# EasyEDA Pro project Esp32.eprj

# Schematic Schematic1
Board Name: Board1; Create Date: 2025-08-05; Page Name: P1; Project Name: Esp32; Schematic Name: Schematic1; Update Date: 2025-09-13; Company: EasyEDA.com; Page Size: A4; Version: V1.0
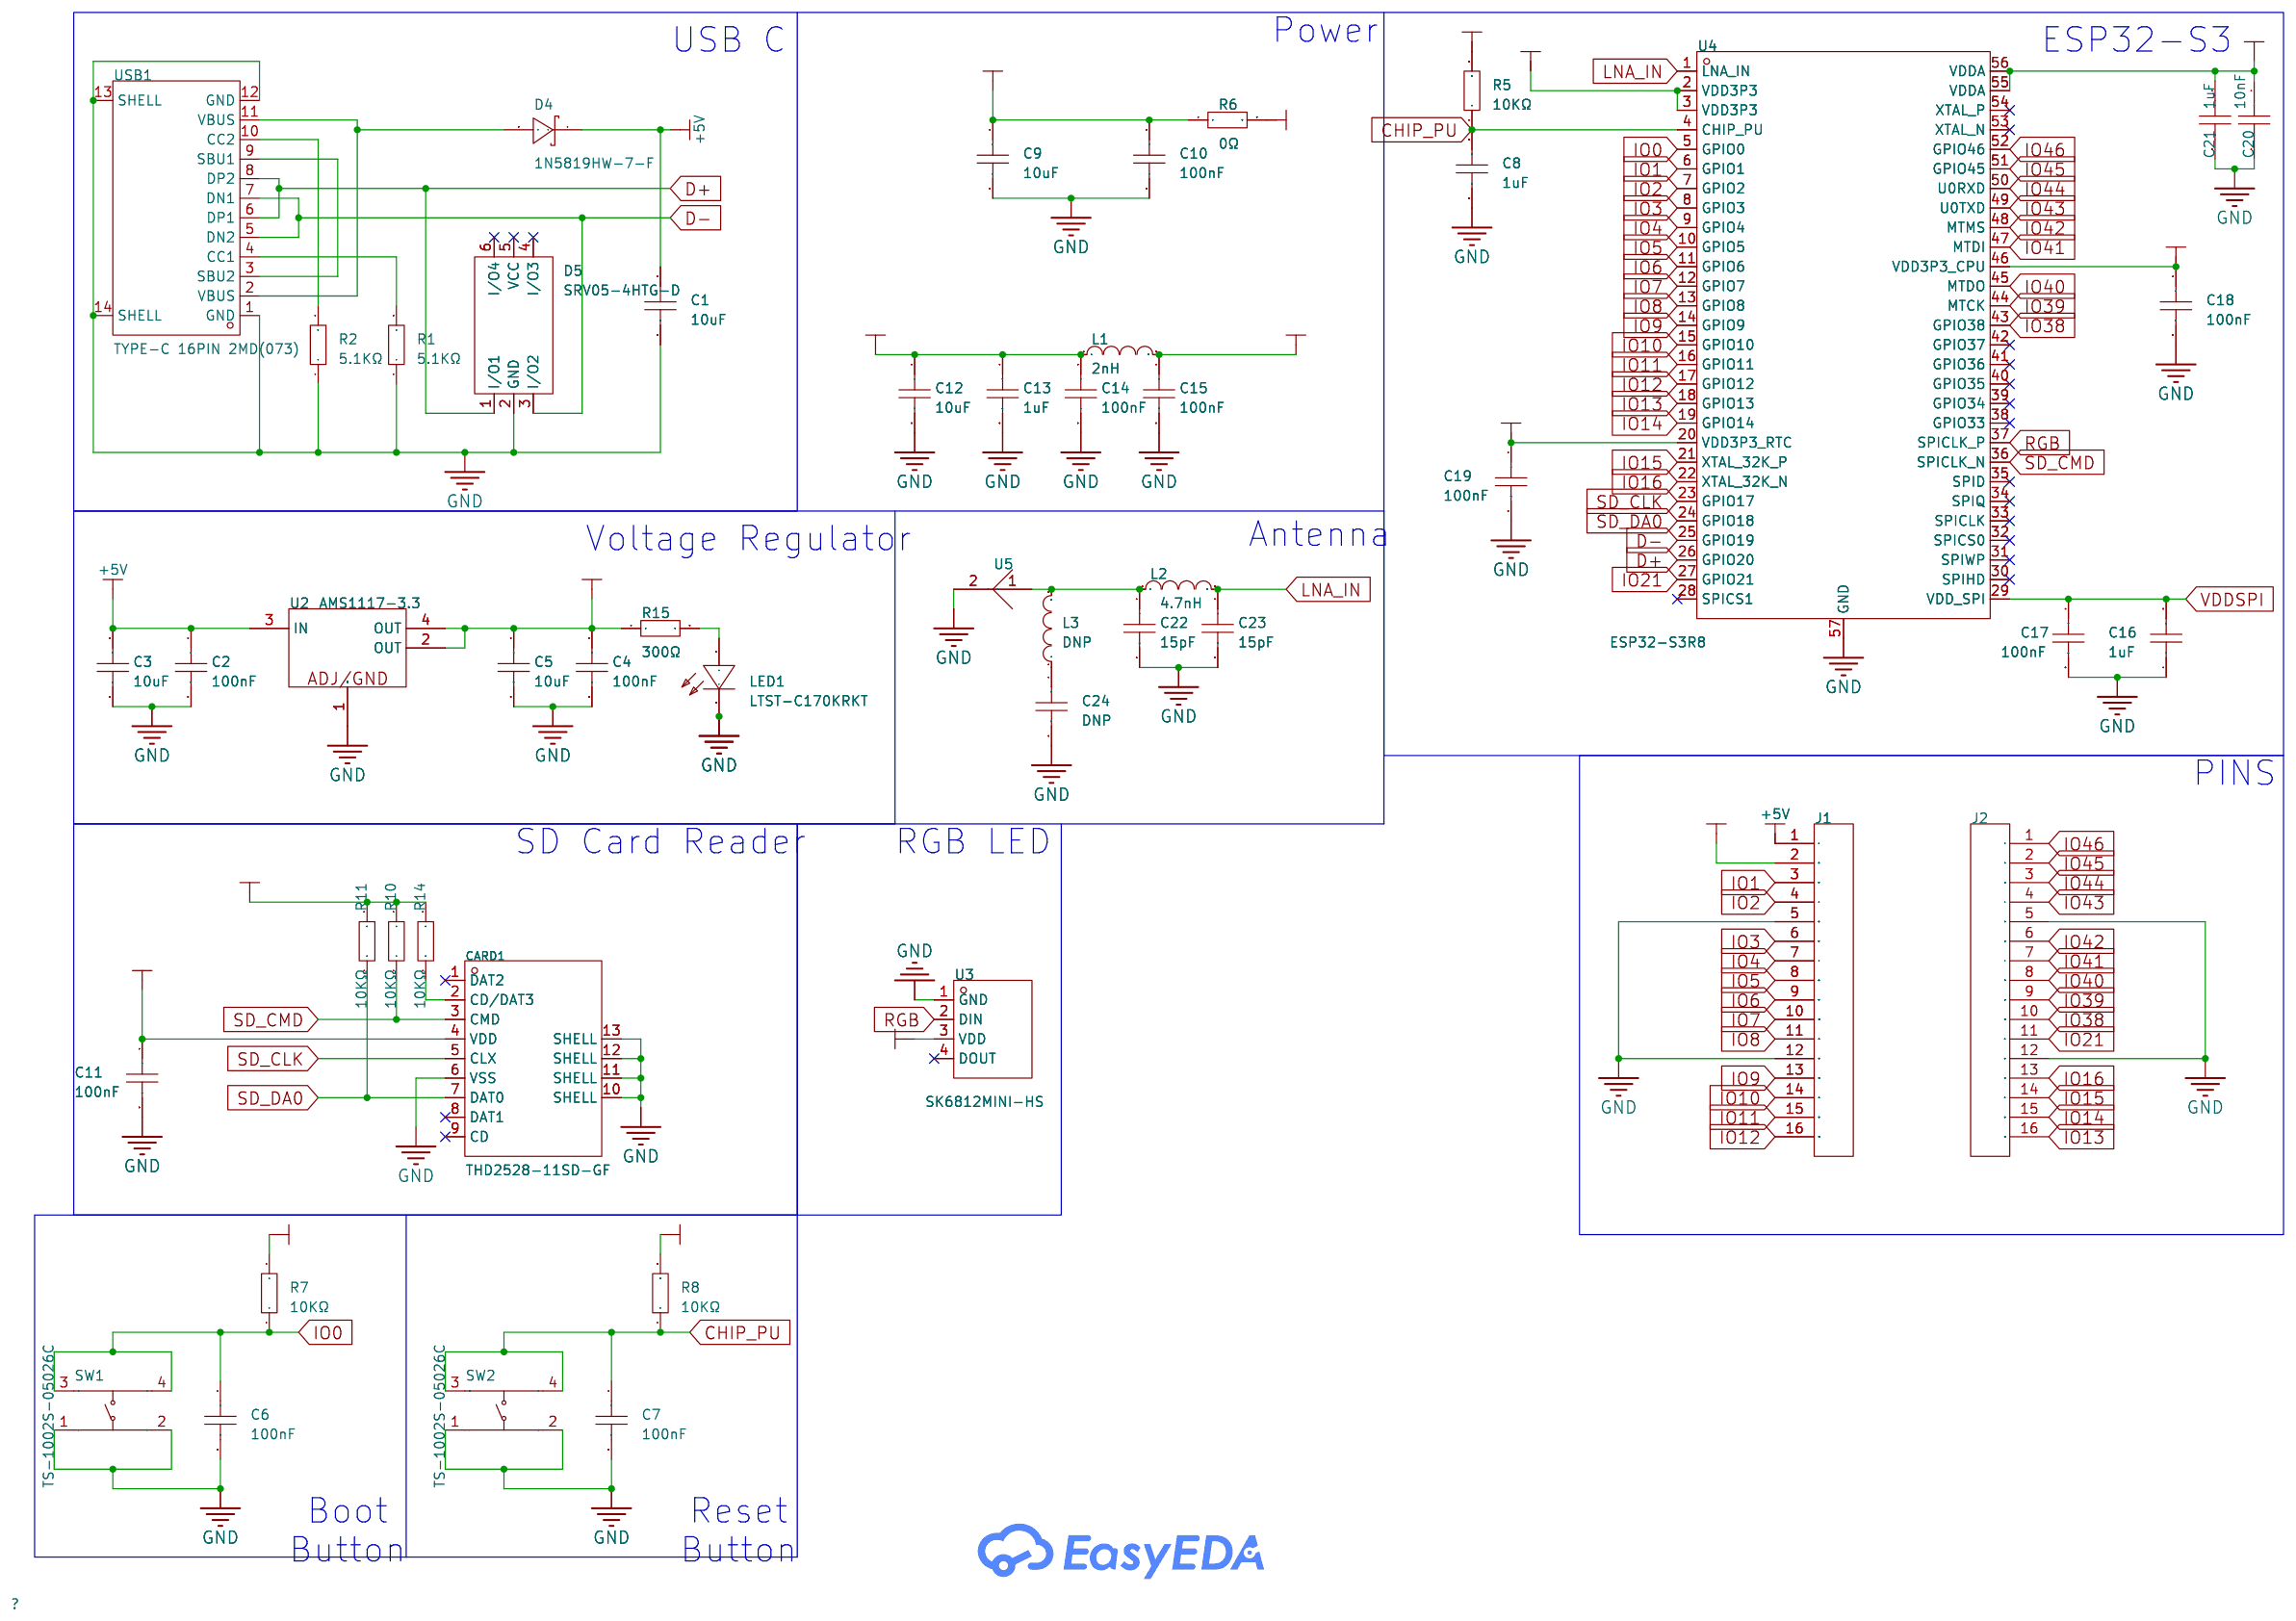
[diagram p0: schematic sheet]

## Parts
C1  10uF  [C0402]
C2  100nF  [C0402]
C3  10uF  [C0402]
C4  100nF  [C0402]
C5  10uF  [C0402]
C6  100nF  [C0402]
C7  100nF  [C0402]
C8  1uF  [C0402]
C9  10uF  [C0402]
C10  100nF  [C0402]
C11  100nF  [C0402]
C12  10uF  [C0402]
C13  1uF  [C0402]
C14  100nF  [C0402]
C15  100nF  [C0402]
C16  1uF  [C0402]
C17  100nF  [C0402]
C18  100nF  [C0402]
C19  100nF  [C0402]
C20  10nF  [C0402]
C21  1uF  [C0402]
C22  15pF  [C0402]
C23  15pF  [C0402]
C24  DNP  [C0402]
CARD1  THD2528-11SD-GF  [TF-SMD_THD2528-11SD-GF]
D4  1N5819HW-7-F  [SOD-123_L2.7-W1.6-LS3.7-RD]
D5  SRV05-4HTG-D  [SOT-23-6_L2.9-W1.6-P0.95-LS2.8-BR]
J1  -  [PinHeader_1x16_P2.54mm_Vertical]
J2  -  [PinHeader_1x16_P2.54mm_Vertical]
L1  2nH  [L0603]
L2  4.7nH  [L0603]
L3  DNP  [L0603]
LED1  LTST-C170KRKT  [LED0805-R-RD]
R1  5.1KΩ  [R0603]
R2  5.1KΩ  [R0603]
R5  10KΩ  [R0402]
R6  0Ω  [R0402]
R7  10KΩ  [R0603]
R8  10KΩ  [R0603]
R10  10KΩ  [R0603]
R11  10KΩ  [R0603]
R14  10KΩ  [R0603]
R15  300Ω  [R0603]
SW1  TS-1002S-05026C  [KEY-SMD_4P-L6.0-W6.0-P4.50-LS9.0]
SW2  TS-1002S-05026C  [KEY-SMD_4P-L6.0-W6.0-P4.50-LS9.0]
U2  AMS1117-3.3  [SOT-223-3_L6.4-W3.5-P2.30-LS7.0-BR]
U3  SK6812MINI-HS  [LED-SMD_4P-L3.5-W3.5-BR_SK6812MINI-HS]
U4  ESP32-S3R8  [QFN-56_L7.0-W7.0-P0.40-TL-EP4.0]
U5  -  [Texas_SWRA117D_2.4GHz_Right]
USB1  TYPE-C 16PIN 2MD(073)  [USB-C-SMD_TYPE-C-6PIN-2MD-073]

## Library data of the parts
C1-C24 = CAP_0402: Supplier Part: C1525; Supplier Footprint: 0402
CARD1 = THD2528-11SD-GF: LCSC Part Name: 自弹式 MicroSD卡(TF卡) 卡座; Supplier Part: C283232; Manufacturer: THD(台华达); Supplier Footprint: SMD; Datasheet: https://atta.szlcsc.com/upload/public/pdf/source/20190329/C283232_532F94C79FB51CC42613BF324E8B5690.pdf; Supplier: LCSC; Card Connection Mode: Self bomb; Card Type: MicroSD卡(TF卡); Connector Type: Deck; Maximum Body Height: 2mm
D4 = 1N5819HW-7-F: LCSC Part Name: 电压:40V 电流:1A; Supplier Part: C82544; Manufacturer: DIODES(美台); Supplier Footprint: SOD-123; JLCPCB Part Class: Extended Part; Datasheet: https://atta.szlcsc.com/upload/public/pdf/source/20161024/1477288459223.pdf; Supplier: LCSC; Forward Voltage (Vf@If): 450mV@1A; Reverse Voltage (Vr): 40V; Rectified Current: 1A; Reverse Leakage Current (Ir): 1mA@40V
D5 = SRV05-4HTG-D: Supplier Part: C1975211; Manufacturer: Littelfuse(美国力特); Supplier Footprint: SOT-23-6; Datasheet: https://item.szlcsc.com/datasheet/SRV05-4HTG-D/2066749.html; Supplier: LCSC; Reverse Stand-Off Voltage (Vrwm): 6V; Clamping Voltage: 15V; Peak Pulse Current (Ipp): 10A@8/20us; Peak Pulse Power Dissipation (Ppp): 150W@8/20us; Voltage - Breakdown: 6V; Reverse Leakage Current (Ir): 500nA; Number of Channels: 4; level of protection: IEC 61000-4-4；IEC 61000-4-5；IEC 61000-4-2; Type: ESD; Junction Capacitance: 1pF
J1 J2 = Conn_1x16
L1 = VHF160808H2N0ST: LCSC Part Name: 2nH ±0.3nH; Supplier Part: C395081; Manufacturer: FH(风华); Supplier Footprint: 0603; JLCPCB Part Class: Extended Part; Datasheet: https://atta.szlcsc.com/upload/public/pdf/source/20230223/8EF545BE87E825DABED9AF3380ABCE94.pdf; Supplier: LCSC
L2 = VHF160808H4N7ST: LCSC Part Name: 4.7nH ±0.3nH; Supplier Part: C1030; Manufacturer: FH(风华); Supplier Footprint: 0603; Datasheet: https://atta.szlcsc.com/upload/public/pdf/source/20230223/8EF545BE87E825DABED9AF3380ABCE94.pdf; Supplier: LCSC
L3 = L_0603
LED1 = LTST-C170KRKT: Supplier Part: C94868; Manufacturer: LITEON(光宝); Supplier Footprint: 0805; JLCPCB Part Class: Extended Part; Datasheet: https://atta.szlcsc.com/upload/public/pdf/source/20170325/1490427902593.pdf; Supplier: LCSC; Emitted Color: Red; Forward Voltage (VF): 2V; Power Dissipation: 75mW; Forward Current: 20mA; Dominant Wavelength: 631nm; Peak Wavelength: 639nm; Lens Color: Colorless Transparent Lens; Luminous Intensity: 54mcd; Viewing Angle: 130°; Operating Temperature: -55℃~+85℃
R1 R2 R7 R8 R10 R11 R14 R15 = Res_0603: Supplier Footprint: 0603
R5 R6 = Res_0402: Supplier Footprint: 0402
SW1 SW2 = TS-1002S-05026C: Circuit:SPST Actuator Style:Round Button Mounting Type:Surface Mount,Vertical Length:6mm Width:6mm Switch Height:5mm Contact Current:50mA Voltage Rating:12V With Lamp:- Life:-; LCSC Part Name: 6*6*5mm 立贴 轻触开关; Supplier Part: C455110; Manufacturer: XUNPU(讯普); Supplier Footprint: SMD-4P,6x6mm; JLCPCB Part Class: Extended Part; Datasheet: https://item.szlcsc.com/datasheet/TS-1002S-05026C/457515.html; Supplier: LCSC; Circuit: SPST; Actuator Style: Round Button; Mounting Type: Surface Mount,Vertical; Length: 6mm; Width: 6mm; Switch Height: 5mm; Contact Current: 50mA; Voltage Rating: 12V
U2 = AMS1117-3.3: Supplier Part: C2992570; Manufacturer: 国芯佳品; Supplier Footprint: SOT-223-3; JLCPCB Part Class: Extended Part; Datasheet: https://atta.szlcsc.com/upload/public/pdf/source/20220729/0D21C21EC310E4778671BF6BAE438640.pdf; Supplier: LCSC; Output Type: Fixed; Voltage - Supply: 15V; Output Voltage: 3.3V; Output Current: 1A; Features: Overcurrent Protection(OCP); Operating Temperature: -40℃~+125℃; Output Configuration: Positive electrode; Number of Outputs: 1
U3 = SK6812MINI-HS: Supplier Part: C2922787; Manufacturer: 欧思科光电; Supplier Footprint: SMD,3.5x3.7mm; Datasheet: https://item.szlcsc.com/datasheet/SK6812MINI-HS/3234155.html; Supplier: LCSC
U4 = ESP32-S3R8: Supplier Part: C2913194; Manufacturer: ESPRESSIF(乐鑫); Supplier Footprint: QFN-56(7x7); JLCPCB Part Class: Extended Part; Datasheet: https://item.szlcsc.com/datasheet/ESP32-S3R8/3198292.html; Supplier: LCSC; Frequency Range: 2.412GHz~2.484GHz; Interface: I2C；I2S；UART；USB；SPI; Voltage - Supply: 3V~3.6V; Applications: Bluetooth；IoT；WiFi; Output Power: 18.5dBm; Data Rate: 150Mbps; Current Of Transmitting: 283mA; Sensitivity: -74.2dBm; Receive Current: 88mA; Typical Application Frequency: 2.4GHz; Operating Temperature: -40℃~+65℃
U5 = Texas_SWRA117D_2.4GHz_Right
USB1 = TYPE-C 16PIN 2MD(073): LCSC Part Name: Type-C 母 卧贴; Supplier Part: C2765186; Manufacturer: SHOU HAN(首韩); Supplier Footprint: SMD; JLCPCB Part Class: Extended Part; Datasheet: https://atta.szlcsc.com/upload/public/pdf/source/20250506/FFB74EDFDFA0AC372CE4A8E4F739CCEF.pdf; Supplier: LCSC; Connector Type: Type-C; Protocol Standard: USB 3.1; Gender: Female; Mounting Type: Surface Mount, Right Angle; Number of Contacts: 16P; Number of Ports: 1; Current Rating-Power: 3A; Voltage Rating: 5V; Connect-Disconnect Life: 5,000 Cycles; Detection color: Black; Operating Temperature: -25℃~+85℃

## Nets
+3V3: C4.1 C5.1 C9.1 C10.1 C11.1 CARD1.4(VDD) J1.2 R6.1 R7.2 R8.2 R10.2 R11.2 R14.2 R15.1 U2.2(OUT) U2.4(OUT) U3.3(VDD)
+5V: C1.1 C2.1 C3.1 D4.1(K) J1.1 U2.3(IN)
GND: C1.2 C2.2 C3.2 C4.2 C5.2 C6.2 C7.2 C8.2 C9.2 C10.2 C11.2 C12.2 C13.2 C14.2 C15.2 C16.1 C17.2 C18.2 C19.2 C20.2 C21.2 C22.2 C23.2 C24.2 CARD1.6(VSS) CARD1.10(SHELL) CARD1.11(SHELL) CARD1.12(SHELL) CARD1.13(SHELL) D5.2(GND) J1.5 J1.12 J2.5 J2.12 LED1.2(-) R1.1 R2.1 SW1.1 SW1.2 SW2.1 SW2.2 U2.1(ADJ/GND) U3.1(GND) U4.57(GND) U5.2 USB1.1(GND) USB1.12(GND) USB1.13(SHELL) USB1.14(SHELL)
VDD3P3: C15.1 L1.2 U4.2(VDD3P3) U4.3(VDD3P3)
VDD33: C12.1 C13.1 C14.1 C18.1 C19.1 C20.1 C21.1 L1.1 R5.2 R6.2 U4.20(VDD3P3_RTC) U4.46(VDD3P3_CPU) U4.55(VDDA) U4.56(VDDA)
VDDSPI: C16.2 C17.1 U4.29(VDD_SPI)
CHIP_PU: C7.1 C8.1 R5.1 R8.1 SW2.3 SW2.4 U4.4(CHIP_PU)
D+: D5.1(I/O1) U4.26(GPIO20) USB1.6(DP1) USB1.8(DP2)
D-: D5.3(I/O2) U4.25(GPIO19) USB1.5(DN2) USB1.7(DN1)
IO0: C6.1 R7.1 SW1.3 SW1.4 U4.5(GPIO0)
IO1: J1.3 U4.6(GPIO1)
IO2: J1.4 U4.7(GPIO2)
IO3: J1.6 U4.8(GPIO3)
IO4: J1.7 U4.9(GPIO4)
IO5: J1.8 U4.10(GPIO5)
IO6: J1.9 U4.11(GPIO6)
IO7: J1.10 U4.12(GPIO7)
IO8: J1.11 U4.13(GPIO8)
IO9: J1.13 U4.14(GPIO9)
IO10: J1.14 U4.15(GPIO10)
IO11: J1.15 U4.16(GPIO11)
IO12: J1.16 U4.17(GPIO12)
IO13: J2.16 U4.18(GPIO13)
IO14: J2.15 U4.19(GPIO14)
IO15: J2.14 U4.21(XTAL_32K_P)
IO16: J2.13 U4.22(XTAL_32K_N)
IO21: J2.11 U4.27(GPIO21)
IO38: J2.10 U4.43(GPIO38)
IO39: J2.9 U4.44(MTCK)
IO40: J2.8 U4.45(MTDO)
IO41: J2.7 U4.47(MTDI)
IO42: J2.6 U4.48(MTMS)
IO43: J2.4 U4.49(U0TXD)
IO44: J2.3 U4.50(U0RXD)
IO45: J2.2 U4.51(GPIO45)
IO46: J2.1 U4.52(GPIO46)
LNA_IN: C23.1 L2.2 U4.1(LNA_IN)
RGB: U3.2(DIN) U4.37(SPICLK_P)
SD_CLK: CARD1.5(CLX) U4.23(GPIO17)
SD_CMD: CARD1.3(CMD) R10.1 U4.36(SPICLK_N)
SD_DA0: CARD1.7(DAT0) R11.1 U4.24(GPIO18)
$1N538: USB1.3(SBU2) USB1.9(SBU1)
$1N689: R2.2 USB1.10(CC2)
$1N692: R1.2 USB1.4(CC1)
$1N1157: D4.2(A) USB1.2(VBUS) USB1.11(VBUS)
$1N2238: LED1.1(+) R15.2
$1N15680: CARD1.2(CD/DAT3) R14.1
$1N27615: C22.1 L2.1 L3.2 U5.1
$1N42405: C24.1 L3.1

Not connected (* = marked no-connect by the designer): CARD1 1(DAT2)* 8(DAT1)* 9(CD)*; D5 4(I/O3)* 5(VCC)* 6(I/O4)*; U3 4(DOUT)*; U4 28(SPICS1)* 30(SPIHD)* 31(SPIWP)* 32(SPICS0)* 33(SPICLK)* 34(SPIQ)* 35(SPID)* 38(GPIO33)* 39(GPIO34)* 40(GPIO35)* 41(GPIO36)* 42(GPIO37)* 53(XTAL_N)* 54(XTAL_P)*

## Notes on the sheet
- USB C
- Power
- ESP32-S3
- Voltage Regulator
- Antenna
- PINS
- SD Card Reader
- RGB LED
- Boot
  Button
- Reset
  Button

# Schematic Schematic1_1
Board Name: Board1_1; Create Date: 2025-08-17; Page Name: P1; Project Name: Esp32; Schematic Name: Schematic1_1; Update Date: 2025-08-17; Company: EasyEDA.com; Page Size: A4; Version: V1.0
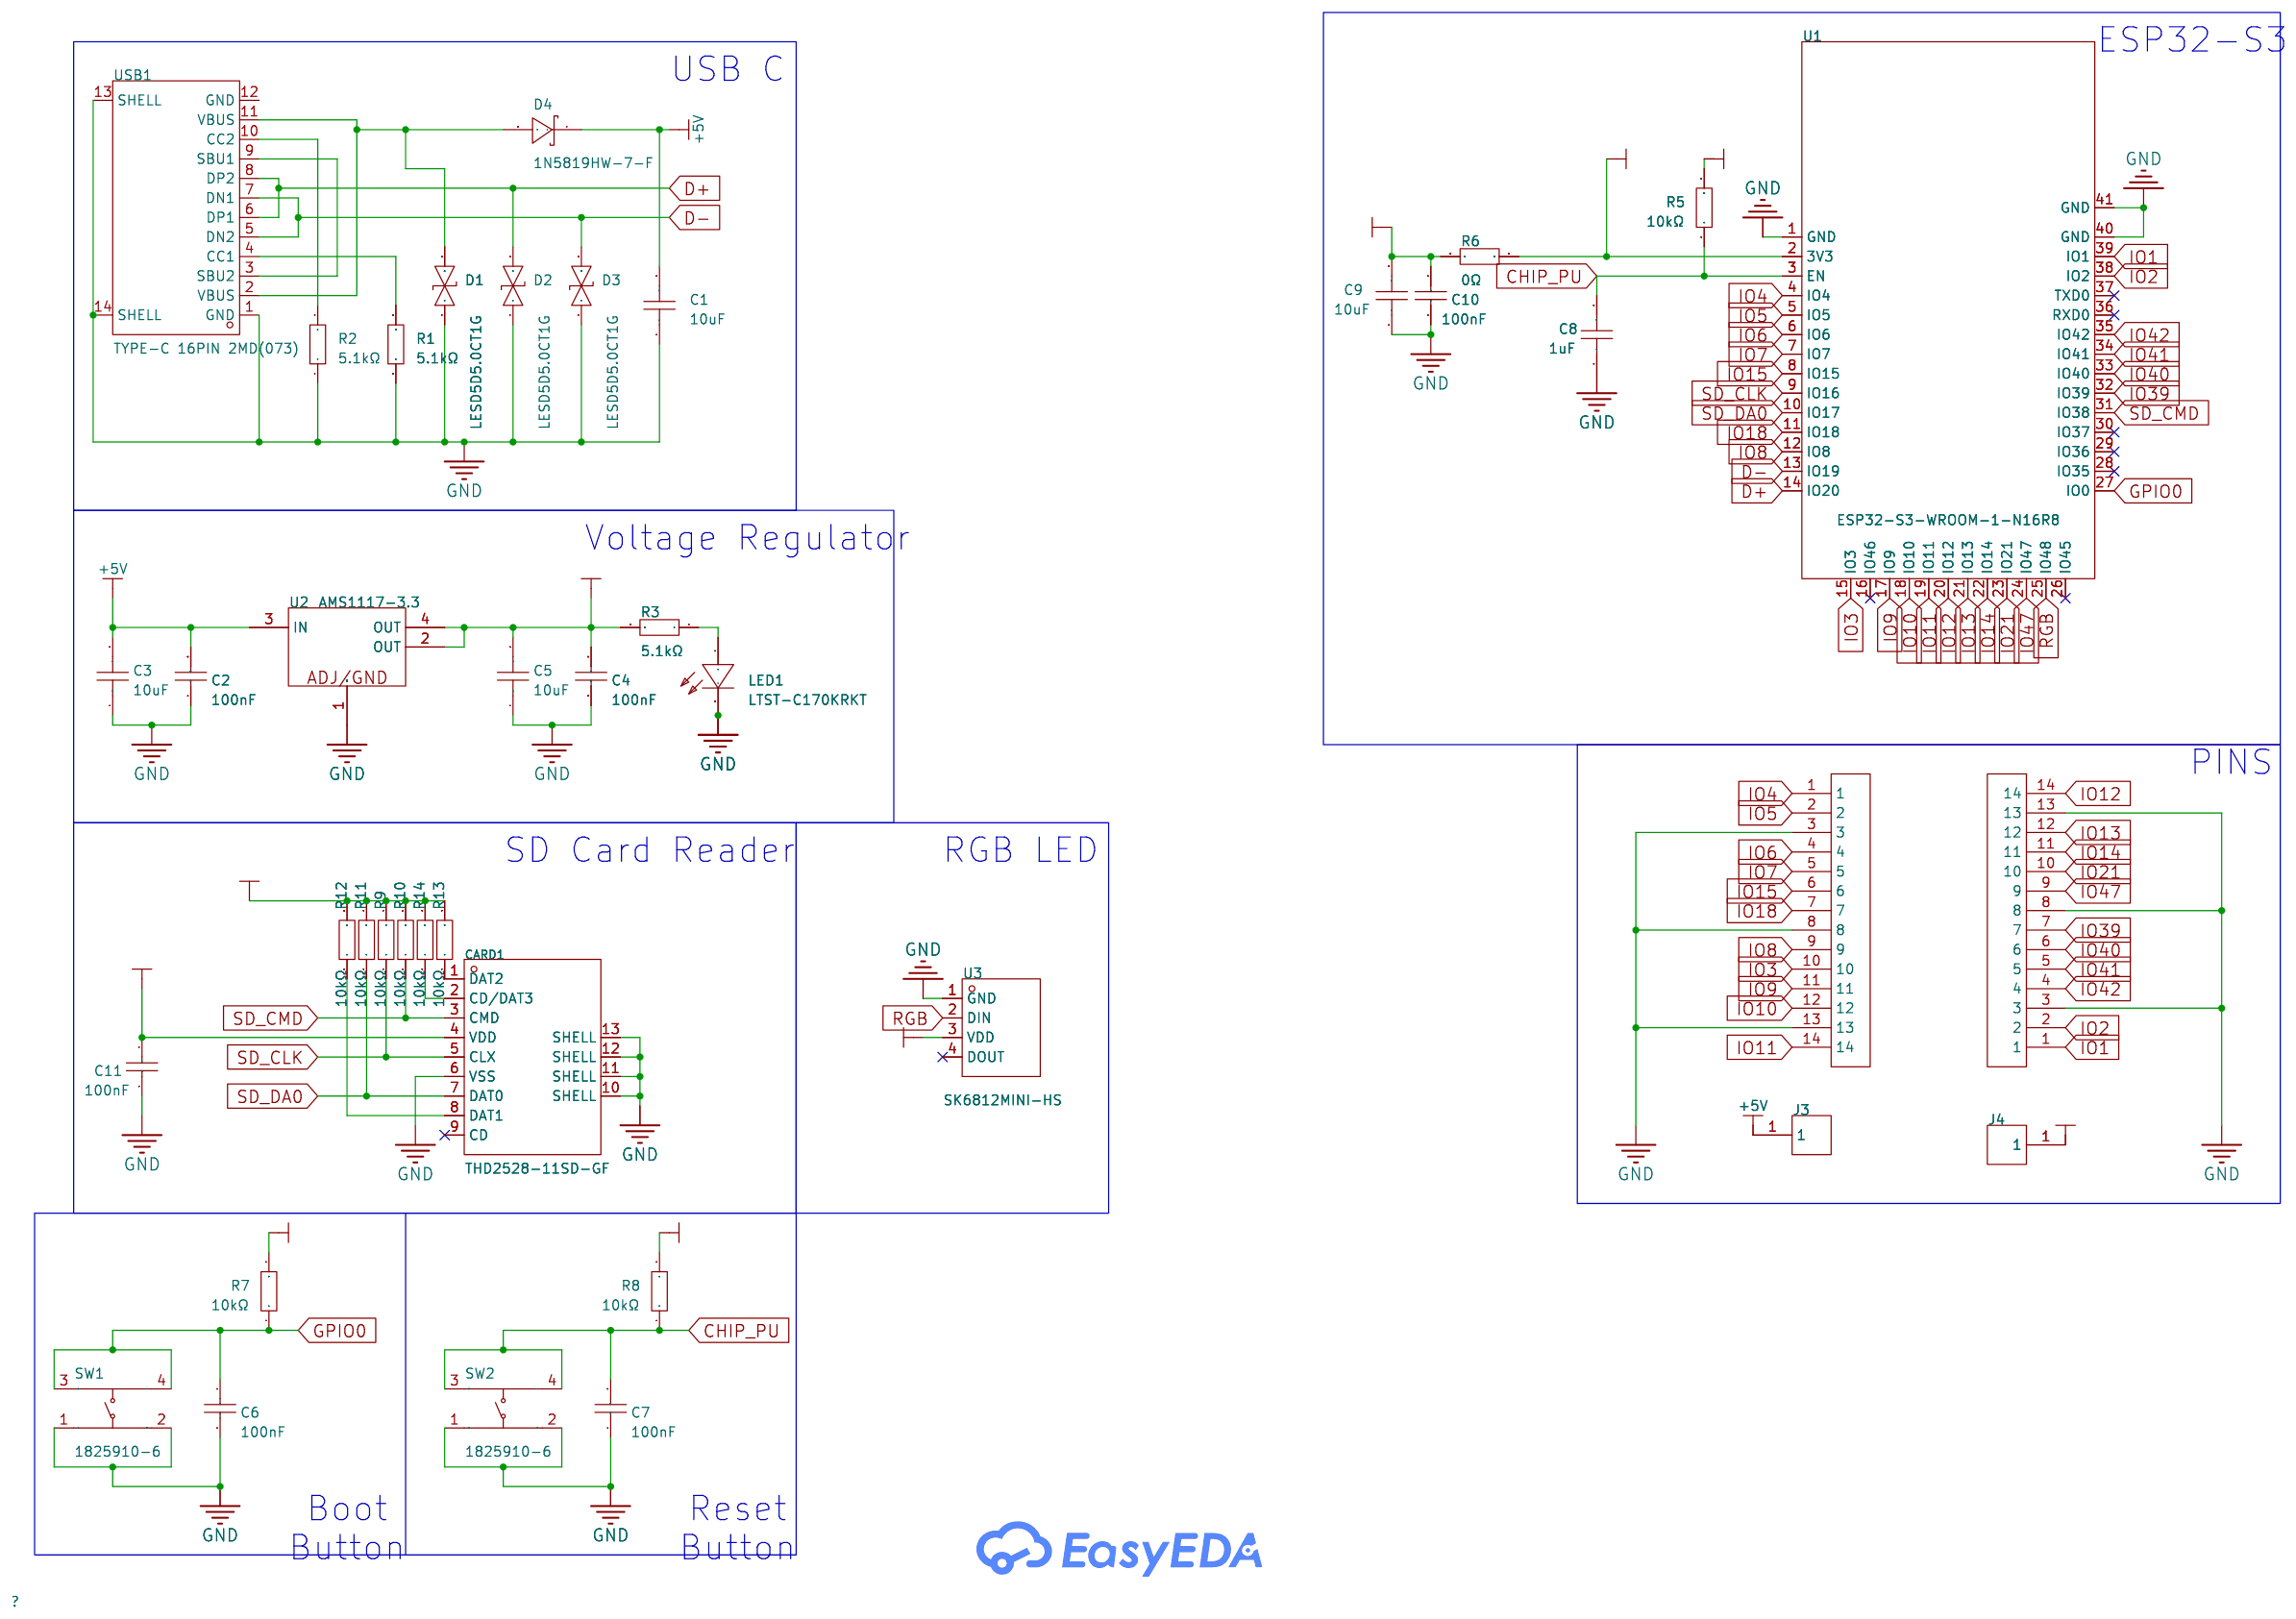
[diagram p1: schematic sheet]

## Parts
C1  10uF  [C0805]
C2  100nF  [C0805]
C3  10uF  [C0805]
C4  100nF  [C0805]
C5  10uF  [C0805]
C6  100nF  [C0805]
C7  100nF  [C0805]
C8  1uF  [C0603]
C9  10uF  [C0805]
C10  100nF  [C0805]
C11  100nF  [C0805]
CARD1  THD2528-11SD-GF  [TF-SMD_THD2528-11SD-GF]
D1  LESD5D5.0CT1G  [SOD-523_L1.2-W0.8-LS1.6-BI]
D2  LESD5D5.0CT1G  [SOD-523_L1.2-W0.8-LS1.6-BI]
D3  LESD5D5.0CT1G  [SOD-523_L1.2-W0.8-LS1.6-BI]
D4  1N5819HW-7-F  [SOD-123_L2.7-W1.6-LS3.7-RD]
J1  -  [CONN-TH_14]
J2  -  [CONN-TH_14]
J3  -  [CONN-TH_1]
J4  -  [CONN-TH_1]
LED1  LTST-C170KRKT  [LED0805-R-RD]
R1  5.1kΩ  [R0402]
R2  5.1kΩ  [R0402]
R3  5.1kΩ  [R0402]
R5  10kΩ  [R0402]
R6  0Ω  [R0402]
R7  10kΩ  [R0402]
R8  10kΩ  [R0402]
R9  10kΩ  [R0402]
R10  10kΩ  [R0402]
R11  10kΩ  [R0402]
R12  10kΩ  [R0402]
R13  10kΩ  [R0402]
R14  10kΩ  [R0402]
SW1  1825910-6  [SW-TH_4P-L6.0-W6.0-P4.50-LS6.5]
SW2  1825910-6  [SW-TH_4P-L6.0-W6.0-P4.50-LS6.5]
U1  ESP32-S3-WROOM-1-N16R8  [WIRELM-SMD_ESP32-S3-WROOM-1]
U2  AMS1117-3.3  [SOT-223-3_L6.4-W3.5-P2.30-LS7.0-BR]
U3  SK6812MINI-HS  [LED-SMD_4P-L3.5-W3.5-BR_SK6812MINI-HS]
USB1  TYPE-C 16PIN 2MD(073)  [USB-C-SMD_TYPE-C-6PIN-2MD-073]

## Library data of the parts
C1 C3 C5 C9 = CL21A106KAYNNNE_C15850: LCSC Part Name: 10uF ±10% 25V; Supplier Part: C15850; Manufacturer: SAMSUNG(三星); Manufacturer Part: CL21A106KAYNNNE; Supplier Footprint: 0805; Datasheet: https://atta.szlcsc.com/upload/public/pdf/source/20160218/1457707763339.pdf; Supplier: LCSC; Tolerance: ±10%
C2 C4 C6 C7 C10 C11 = CL21B104KBCNNNC: LCSC Part Name: 100nF ±10% 50V; Supplier Part: C1711; Manufacturer: SAMSUNG(三星); Supplier Footprint: 0805; JLCPCB Part Class: Extended Part; Datasheet: https://atta.szlcsc.com/upload/public/pdf/source/20160218/1457707763339.pdf; Supplier: LCSC; Tolerance: ±10%
C8 = C0603X5R105K160NT: LCSC Part Name: 1uF ±10% 16V; Supplier Part: C475249; Manufacturer: SANYEAR(叁叶源); Supplier Footprint: 0603; Datasheet: https://atta.szlcsc.com/upload/public/pdf/source/20200102/C475251_1E30ECAC0E8AE7254982658A02A2D78C.pdf; Supplier: LCSC; Tolerance: ±10%
CARD1 = THD2528-11SD-GF: LCSC Part Name: 自弹式 MicroSD卡(TF卡) 卡座; Supplier Part: C283232; Manufacturer: THD(台华达); Supplier Footprint: SMD; Datasheet: https://atta.szlcsc.com/upload/public/pdf/source/20190329/C283232_532F94C79FB51CC42613BF324E8B5690.pdf; Supplier: LCSC; Card Connection Mode: Self bomb; Card Type: MicroSD卡(TF卡); Connector Type: Deck; Maximum Body Height: 2mm
D1-D3 = LESD5D5.0CT1G: LCSC Part Name: 双向ESD; Supplier Part: C383211; Manufacturer: LRC(乐山无线电); Supplier Footprint: SOD-523; JLCPCB Part Class: Extended Part; Datasheet: https://atta.szlcsc.com/upload/public/pdf/source/20190807/C383211_633DF4B4E2C161403226E5235FE33A1C.pdf; Supplier: LCSC; Polarity: Bidirectional; Reverse Stand-Off Voltage (Vrwm): 5V; Clamping Voltage: 18.6V; Peak Pulse Current (Ipp): 9.4A; Voltage - Breakdown: 5.6V; Type: ESD
D4 = 1N5819HW-7-F: LCSC Part Name: 电压:40V 电流:1A; Supplier Part: C82544; Manufacturer: DIODES(美台); Supplier Footprint: SOD-123; JLCPCB Part Class: Extended Part; Datasheet: https://atta.szlcsc.com/upload/public/pdf/source/20161024/1477288459223.pdf; Supplier: LCSC; Forward Voltage (Vf@If): 450mV@1A; Reverse Voltage (Vr): 40V; Rectified Current: 1A; Reverse Leakage Current (Ir): 1mA@40V
J1 J2 = CONN-TH_14
J3 J4 = CONN-TH_1
LED1 = LTST-C170KRKT: Supplier Part: C94868; Manufacturer: LITEON(光宝); Supplier Footprint: 0805; JLCPCB Part Class: Extended Part; Datasheet: https://atta.szlcsc.com/upload/public/pdf/source/20170325/1490427902593.pdf; Supplier: LCSC; Emitted Color: Red; Forward Voltage (VF): 2V; Power Dissipation: 75mW; Forward Current: 20mA; Dominant Wavelength: 631nm; Peak Wavelength: 639nm; Lens Color: Colorless Transparent Lens; Luminous Intensity: 54mcd; Viewing Angle: 130°; Operating Temperature: -55℃~+85℃
R1-R3 = AR02BTD5101: LCSC Part Name: 薄膜电阻 5.1kΩ ±0.1% 62.5mW; Supplier Part: C319559; Manufacturer: Viking(光颉); Supplier Footprint: 0402; Datasheet: https://atta.szlcsc.com/upload/public/pdf/source/20191129/C465721_10D49275DB41E427863CE9C8D788770A.pdf; Supplier: LCSC; Type: Thin Film Resistor; Tolerance: ±0.1%; Temperature Coefficient: ±50ppm/℃; Operating Temperature Range: -55℃~+155℃
R5 R7-R14 = RC0402FR-0710KL: LCSC Part Name: 厚膜电阻 10kΩ ±1% 62.5mW; Supplier Part: C60490; Manufacturer: YAGEO(国巨); Supplier Footprint: 0402; Datasheet: https://atta.szlcsc.com/upload/public/pdf/source/20170925/C131467_1506321478108990263.pdf; Supplier: LCSC; Type: Thick Film Resistors; Tolerance: ±1%; Temperature Coefficient: ±100ppm/℃; Operating Temperature Range: -55℃~+155℃
R6 = RC0402FR-070RL: LCSC Part Name: 厚膜电阻 0Ω ±1% 62.5mW; Supplier Part: C106231; Manufacturer: YAGEO(国巨); Supplier Footprint: 0402; Datasheet: https://atta.szlcsc.com/upload/public/pdf/source/20180927/C295883_E8D83085EA81BD7DE0B2B681138C15EE.pdf; Supplier: LCSC; Type: Thick Film Resistors; Tolerance: ±1%; Power(Watts): 62.5mW; Voltage-Supply(Max): 50V; Operating Temperature: -55℃~+155℃
SW1 SW2 = 1825910-6: LCSC Part Name: 6*6*5mm 直插 轻触开关; Supplier Part: C428628; Manufacturer: TE Connectivity(泰科电子); Supplier Footprint: 插件; Datasheet: https://atta.szlcsc.com/upload/public/pdf/source/20190912/C428628_64BAA15C1B0D0A7FBB2C11BEC7714D6D.pdf; Supplier: LCSC; Circuit: SPST; Actuator Style: Round Button; Operating Force: 160gf; Mounting Style: Direct Insert; Switch Length: 6mm; Switch Width: 6mm; Switch Height: 5mm; Contact Current: 50mA; Voltage Rating (DC): 24V; Pin Style: PCPin; Operating Temperature: -35℃~+85℃
U1 = ESP32-S3-WROOM-1-N16R8: LCSC Part Name: 通用型Wi-Fi+低功耗蓝牙MCU模组; Supplier Part: C2913202; Manufacturer: ESPRESSIF(乐鑫); Supplier Footprint: SMD,18x25.5mm; Datasheet: https://atta.szlcsc.com/upload/public/pdf/source/20241030/6A412B13087E1327DF6279F5735253CA.pdf; Supplier: LCSC
U2 = AMS1117-3.3: Supplier Part: C2992570; Manufacturer: 国芯佳品; Supplier Footprint: SOT-223-3; JLCPCB Part Class: Extended Part; Datasheet: https://atta.szlcsc.com/upload/public/pdf/source/20220729/0D21C21EC310E4778671BF6BAE438640.pdf; Supplier: LCSC; Output Type: Fixed; Voltage - Supply: 15V; Output Voltage: 3.3V; Output Current: 1A; Features: Overcurrent Protection(OCP); Operating Temperature: -40℃~+125℃; Output Configuration: Positive electrode; Number of Outputs: 1
U3 = SK6812MINI-HS: Supplier Part: C2922787; Manufacturer: 欧思科光电; Supplier Footprint: SMD,3.5x3.7mm; Datasheet: https://item.szlcsc.com/datasheet/SK6812MINI-HS/3234155.html; Supplier: LCSC
USB1 = TYPE-C 16PIN 2MD(073): LCSC Part Name: Type-C 母 卧贴; Supplier Part: C2765186; Manufacturer: SHOU HAN(首韩); Supplier Footprint: SMD; JLCPCB Part Class: Extended Part; Datasheet: https://atta.szlcsc.com/upload/public/pdf/source/20250506/FFB74EDFDFA0AC372CE4A8E4F739CCEF.pdf; Supplier: LCSC; Connector Type: Type-C; Protocol Standard: USB 3.1; Gender: Female; Mounting Type: Surface Mount, Right Angle; Number of Contacts: 16P; Number of Ports: 1; Current Rating-Power: 3A; Voltage Rating: 5V; Connect-Disconnect Life: 5,000 Cycles; Detection color: Black; Operating Temperature: -25℃~+85℃

## Nets
+3V3: C4.2 C5.2 C9.2 C10.2 C11.1 CARD1.4(VDD) J4.1 R3.2 R6.1 R7.2 R8.2 R9.2 R10.2 R11.2 R12.2 R13.2 R14.2 U2.2(OUT) U2.4(OUT) U3.3(VDD)
+5V: C1.2 C2.2 C3.2 D4.1(K) J3.1 U2.3(IN)
GND: C1.1 C2.1 C3.1 C4.1 C5.1 C6.1 C7.1 C8.1 C9.1 C10.1 C11.2 CARD1.6(VSS) CARD1.10(SHELL) CARD1.11(SHELL) CARD1.12(SHELL) CARD1.13(SHELL) D1.1 D2.1 D3.1 J1.3 J1.8 J1.13 J2.3 J2.8 J2.13 LED1.2(-) R1.1 R2.1 SW1.1 SW1.2 SW2.1 SW2.2 U1.1(GND) U1.40(GND) U1.41(GND) U2.1(ADJ/GND) U3.1(GND) USB1.1(GND) USB1.13(SHELL) USB1.14(SHELL)
CHIP_PU: C7.2 C8.2 R5.1 R8.1 SW2.3 SW2.4 U1.3(EN)
D+: D2.2 U1.14(IO20) USB1.6(DP1) USB1.8(DP2)
D-: D3.2 U1.13(IO19) USB1.5(DN2) USB1.7(DN1)
ESP_3V3: R5.2 R6.2 U1.2(3V3)
GPIO0: C6.2 R7.1 SW1.3 SW1.4 U1.27(IO0)
IO1: J2.1 U1.39(IO1)
IO2: J2.2 U1.38(IO2)
IO3: J1.10 U1.15(IO3)
IO4: J1.1 U1.4(IO4)
IO5: J1.2 U1.5(IO5)
IO6: J1.4 U1.6(IO6)
IO7: J1.5 U1.7(IO7)
IO8: J1.9 U1.12(IO8)
IO9: J1.11 U1.17(IO9)
IO10: J1.12 U1.18(IO10)
IO11: J1.14 U1.19(IO11)
IO12: J2.14 U1.20(IO12)
IO13: J2.12 U1.21(IO13)
IO14: J2.11 U1.22(IO14)
IO15: J1.6 U1.8(IO15)
IO18: J1.7 U1.11(IO18)
IO21: J2.10 U1.23(IO21)
IO39: J2.7 U1.32(IO39)
IO40: J2.6 U1.33(IO40)
IO41: J2.5 U1.34(IO41)
IO42: J2.4 U1.35(IO42)
IO47: J2.9 U1.24(IO47)
RGB: U1.25(IO48) U3.2(DIN)
SD_CLK: CARD1.5(CLX) R9.1 U1.9(IO16)
SD_CMD: CARD1.3(CMD) R10.1 U1.31(IO38)
SD_DA0: CARD1.7(DAT0) R11.1 U1.10(IO17)
$1N538: USB1.3(SBU2) USB1.9(SBU1)
$1N689: R2.2 USB1.10(CC2)
$1N692: R1.2 USB1.4(CC1)
$1N1157: D1.2 D4.2(A) USB1.2(VBUS) USB1.11(VBUS)
$1N2238: LED1.1(+) R3.1
$1N15670: CARD1.1(DAT2) R13.1
$1N15680: CARD1.2(CD/DAT3) R14.1
$1N15711: CARD1.8(DAT1) R12.1

Not connected (* = marked no-connect by the designer): CARD1 9(CD)*; U1 16(IO46)* 26(IO45)* 28(IO35)* 29(IO36)* 30(IO37)* 36(RXD0)* 37(TXD0)*; U3 4(DOUT)*; USB1 12(GND)

## Notes on the sheet
- ESP32-S3
- USB C
- Voltage Regulator
- PINS
- SD Card Reader
- RGB LED
- Boot
  Button
- Reset
  Button

# Board PCB1
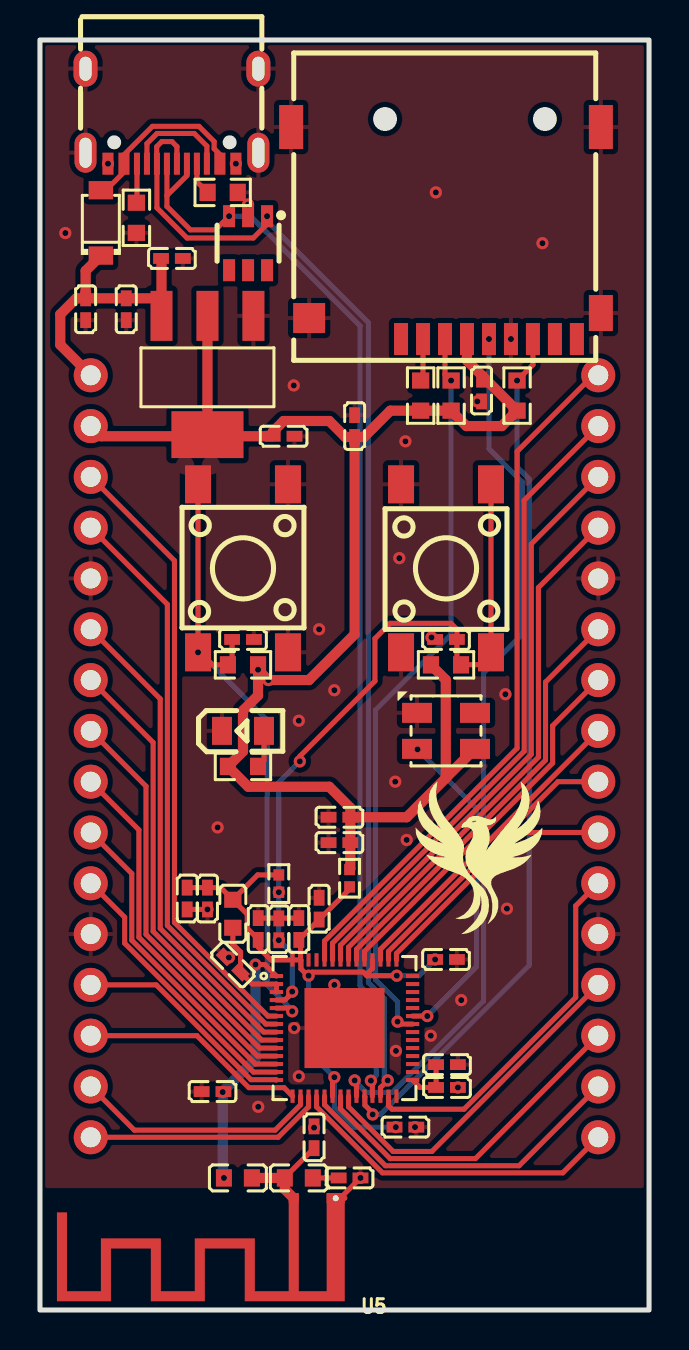
[diagram p2: board, top side]
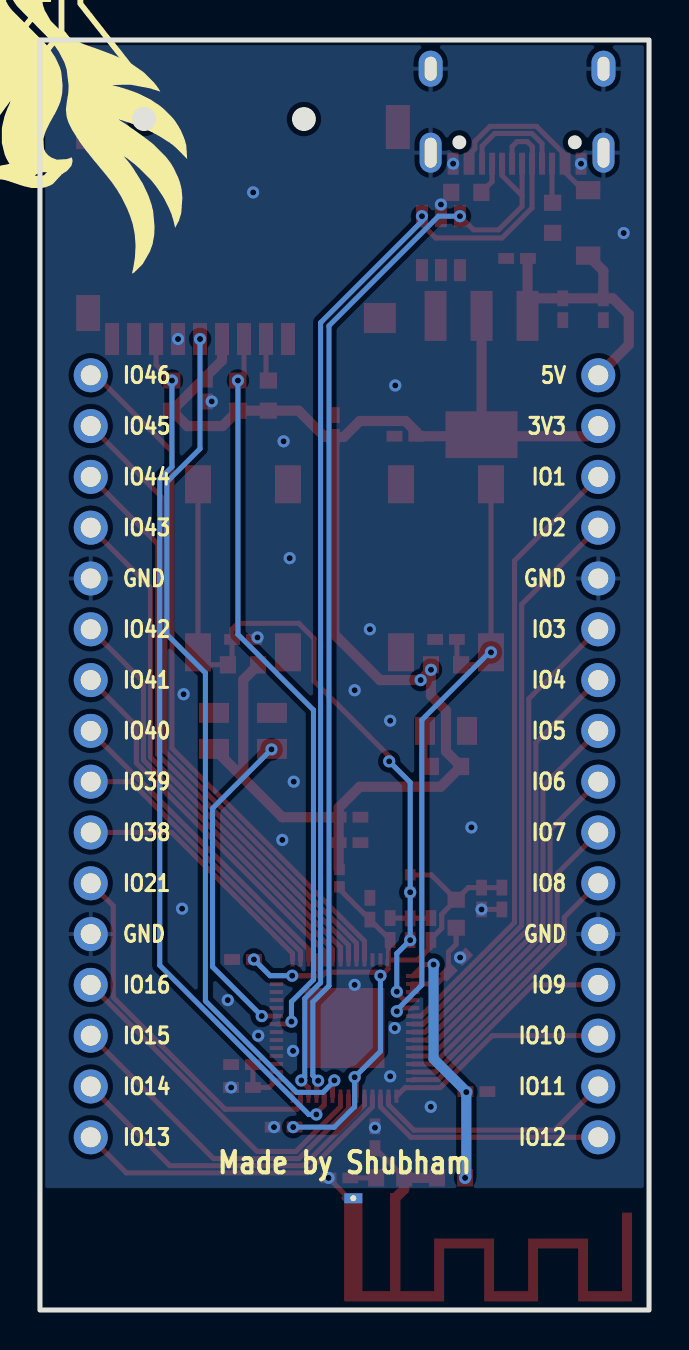
[diagram p3: board, bottom side, seen from below]

Outline 30.48 x 63.5 mm; copper layers: Top Layer, Bottom Layer. Coordinates in mm from the lower left corner of the outline.
Outline path: rectangle 0,63.5 30.48,0
Stack: Top Layer 0.035mm / Dielectric1 1.51mm FR4 er 4.5 / Bottom Layer 0.035mm

## Design rules (mm)
net D-: DP1
net D+: DP1
template: JLCPCB Capability(Two Layers Board)
spacing copperThickness1oz (default): track to track 0.102, other pairs 0.152 to 0.3
spacing copperThickness2oz: track to track 0.203, other pairs 0.152 to 0.3
track width copperThickness1oz (default): min 0.127, default 0.254, max 2.54
track width copperThickness2oz: min 0.203, default 0.254, max 2.54
differential pair differentialPair (default): width min 0.127, default 0.254, max 2.54; gap min 0.152, default 0.152
via viaSize (default): diameter min 0.5, default 0.61, max 10; hole min 0.3, default 0.305, max 6.3

## Placement (name value [footprint] x y rotation side)
C1  10uF  [C0402]  6.6 52.58 0 top
C2  100nF  [C0402]  4.32 50.04 270 top
C3  10uF  [C0402]  2.29 50.04 270 top
C4  100nF  [C0402]  12.19 43.69 0 top
C5  10uF  [C0402]  15.75 44.2 90 top
C6  100nF  [C0402]  10.16 33.53 0 top
C7  100nF  [C0402]  20.32 33.53 180 top
C8  1uF  [C0402]  11.95 19.04 90 top
C9  10uF  [C0402]  14.99 23.37 180 top
C10  100nF  [C0402]  14.99 24.64 180 top
C11  100nF  [C0402]  22.1 45.97 270 top
C12  10uF  [C0402]  7.37 20.57 270 top
C13  1uF  [C0402]  8.38 20.57 270 top
C14  100nF  [C0402]  10.92 19.05 90 top
C15  100nF  [C0402]  9.65 17.27 135 top
C16  1uF  [C0402]  20.37 12.27 180 top
C17  100nF  [C0402]  20.37 11.13 0 top
C18  100nF  [C0402]  20.32 17.53 0 top
C19  100nF  [C0402]  18.29 9.14 0 top
C20  10nF  [C0402]  12.95 19.05 90 top
C21  1uF  [C0402]  13.97 20.07 90 top
C22  15pF  [C0402]  13.72 8.64 90 top
C23  15pF  [C0402]  8.64 10.92 180 top
C24  DNP  [C0402]  15.49 6.6 0 top
CARD1  THD2528-11SD-GF  [TF-SMD_THD2528-11SD-GF]  20.32 53.85 180 top
D4  1N5819HW-7-F  [SOD-123_L2.7-W1.6-LS3.7-RD]  3.05 54.36 90 top
D5  SRV05-4HTG-D  [SOT-23-6_L2.9-W1.6-P0.95-LS2.8-BR]  10.41 53.34 90 top
J1  -  [PinHeader_1x16_P2.54mm_Vertical]  2.54 46.74 0 top
J2  -  [PinHeader_1x16_P2.54mm_Vertical]  27.94 46.74 0 top
L1  2nH  [L0603]  9.65 19.81 270 top
L2  4.7nH  [L0603]  9.91 6.6 180 top
L3  DNP  [L0603]  12.95 6.6 180 top
LED1  LTST-C170KRKT  [LED0805-R-RD]  10.16 28.96 0 top
R1  5.1KΩ  [R0603]  9.14 55.88 180 top
R2  5.1KΩ  [R0603]  4.83 54.61 90 top
R5  10KΩ  [R0402]  11.95 21.32 90 top
R6  0Ω  [R0402]  15.49 21.59 270 top
R7  10KΩ  [R0603]  10.16 32.26 0 top
R8  10KΩ  [R0603]  20.32 32.26 180 top
R10  10KΩ  [R0603]  20.57 45.72 270 top
R11  10KΩ  [R0603]  23.88 45.72 270 top
R14  10KΩ  [R0603]  19.05 45.72 270 top
R15  300Ω  [R0603]  10.16 27.18 0 top
SW1  TS-1002S-05026C  [KEY-SMD_4P-L6.0-W6.0-P4.50-LS9.0]  10.16 37.08 270 top
SW2  TS-1002S-05026C  [KEY-SMD_4P-L6.0-W6.0-P4.50-LS9.0]  20.32 37.08 90 top
U2  AMS1117-3.3  [SOT-223-3_L6.4-W3.5-P2.30-LS7.0-BR]  8.38 46.74 90 top
U3  SK6812MINI-HS  [LED-SMD_4P-L3.5-W3.5-BR_SK6812MINI-HS]  20.32 28.96 180 top
U4  ESP32-S3R8  [QFN-56_L7.0-W7.0-P0.40-TL-EP4.0]  15.24 14.1 0 top
U5  -  [Texas_SWRA117D_2.4GHz_Right]  12.7 5.59 180 top
USB1  TYPE-C 16PIN 2MD(073)  [USB-C-SMD_TYPE-C-6PIN-2MD-073]  6.6 59.69 180 top

## Footprints (pads in the part's own frame, mm; a bottom-side part is the same pattern mirrored in y, then rotated)
C0402
  rect 0.79x0.54 smd: 1(-0.545,0) 2(0.545,0)
KEY-SMD_4P-L6.0-W6.0-P4.50-LS9.0
  rect 1.9x1.3 smd: 1(-4.2,2.25) 2(4.2,2.25) 3(-4.2,-2.25) 4(4.2,-2.25)
L0603
  rect 0.8x0.864 smd: 1(-0.7,0) 2(0.7,0)
LED0805-R-RD
  rect 1x1.399 smd: 1(1.05,0) 2(-1.05,0)
LED-SMD_4P-L3.5-W3.5-BR_SK6812MINI-HS
  rect 1.5x1 smd: 1(1.45,-0.9) 2(1.45,0.9) 3(-1.45,0.9) 4(-1.45,-0.9)
PinHeader_1x16_P2.54mm_Vertical
  round 1.7 hole 1: 1(0,0) 2(0,-2.54) 3(0,-5.08) 4(0,-7.62) 5(0,-10.16) 6(0,-12.7) 7(0,-15.24) 8(0,-17.78) 9(0,-20.32) 10(0,-22.86) 11(0,-25.4) 12(0,-27.94) 13(0,-30.48) 14(0,-33.02) 15(0,-35.56) 16(0,-38.1)
QFN-56_L7.0-W7.0-P0.40-TL-EP4.0
  rect 0.665x0.2 smd: 1(-3.408,2.6) 2(-3.408,2.2) 3(-3.408,1.8) 4(-3.408,1.4) 5(-3.408,1) 6(-3.408,0.6) 7(-3.408,0.2) 8(-3.408,-0.2) 9(-3.408,-0.6) 10(-3.408,-1) 11(-3.408,-1.4) 12(-3.408,-1.8) 13(-3.408,-2.2) 14(-3.408,-2.6) 29(3.408,-2.6) 30(3.408,-2.2) 31(3.408,-1.8) 32(3.408,-1.4) 33(3.408,-1) 34(3.408,-0.6) 35(3.408,-0.2) 36(3.408,0.2) 37(3.408,0.6) 38(3.408,1) 39(3.408,1.4) 40(3.408,1.8) 41(3.408,2.2) 42(3.408,2.6)
  rect 0.2x0.665 smd: 15(-2.6,-3.408) 16(-2.2,-3.408) 17(-1.8,-3.408) 18(-1.4,-3.408) 19(-1,-3.408) 20(-0.6,-3.408) 21(-0.2,-3.408) 22(0.2,-3.408) 23(0.6,-3.408) 24(1,-3.408) 25(1.4,-3.408) 26(1.8,-3.408) 27(2.2,-3.408) 28(2.6,-3.408) 43(2.6,3.408) 44(2.2,3.408) 45(1.8,3.408) 46(1.4,3.408) 47(1,3.408) 48(0.6,3.408) 49(0.2,3.408) 50(-0.2,3.408) 51(-0.6,3.408) 52(-1,3.408) 53(-1.4,3.408) 54(-1.8,3.408) 55(-2.2,3.408) 56(-2.6,3.408)
  rect 4x4 smd: 57(0,0)
R0402
  rect 0.566x0.54 smd: 1(-0.433,0) 2(0.433,0)
R0603
  rect 0.806x0.864 smd: 1(-0.753,0) 2(0.753,0)
SOD-123_L2.7-W1.6-LS3.7-RD
  rect 0.91x1.22 smd: 1(-1.635,0) 2(1.635,0)
SOT-23-6_L2.9-W1.6-P0.95-LS2.8-BR
  rect 1.1x0.6 smd: 1(1.35,-0.95) 2(1.35,0) 3(1.35,0.95) 4(-1.35,0.95) 5(-1.35,0) 6(-1.35,-0.95)
SOT-223-3_L6.4-W3.5-P2.30-LS7.0-BR
  rect 2.5x1.1 smd: 1(2.97,-2.3) 2(2.97,0) 3(2.97,2.3)
  rect 2.34x3.6 smd: 4(-2.97,0)
Texas_SWRA117D_2.4GHz_Right
  rect 0.5x0.5 smd: 1(0,0)
  rect 0.9x0.5 hole 0.3: 2(-2.1,0)
TF-SMD_THD2528-11SD-GF
  rect 0.7x1.6 smd: 1(2.25,5.3) 2(1.15,5.3) 3(0.05,5.3) 4(-1.05,5.3) 5(-2.15,5.3) 6(-3.25,5.3) 7(-4.35,5.3) 8(-5.45,5.3) 9(-6.55,5.3)
  rect 1.2x1.8 smd: 10(-7.75,4)
  rect 1.2x2.2 smd: 11(-7.75,-5.3) 12(7.75,-5.3)
  rect 1.6x1.5 smd: 13(6.85,4.25)
USB-C-SMD_TYPE-C-6PIN-2MD-073
  rect 0.55x1.1 smd: 1(-3.2,2.375) 2(-2.4,2.375) 11(2.4,2.375) 12(3.2,2.375)
  rect 0.3x1.1 smd: 3(-1.75,2.375) 4(-1.25,2.375) 5(-0.75,2.375) 6(-0.25,2.375) 7(0.25,2.375) 8(0.75,2.375) 9(1.25,2.375) 10(1.75,2.375)
  oval 1.1x2 hole 0.6x1.5: 13(-4.325,1.825) 14(4.325,1.825)
  oval 1.2x1.8 hole 0.6x1.2: 13(-4.325,-2.375) 14(4.325,-2.375)

## Nets
As in the schematic.

Pads without a net: CARD1 1 8 9; D5 4 5 6; U3 4; U4 28 30 31 32 33 34 35 38 39 40 41 42 53 54

## Via types
v1: diameter 0.61, hole 0.305, Top Layer to Bottom Layer, 61 vias

## Routing (per net, layer and track width the routed paths; a pad name or vN(x,y) marks a point on that pad's centre or on a via; arc(x,y) is an arc through that point)
+3V3: length 79.7
  Top Layer w0.254: 22.32,46.52 C11.1
  Top Layer w0.508: 19.57,32.25 20.31,31.51 20.31,26.6 ; C5.1 15.28,43.65 14.48,44.45 12.19,44.45 11.65,43.91 C4.1 8.46,43.69 U2.4 ; C5.1 15.75,33.78 13.46,31.5 v1(11.43,31.5) v1(10.91,32.01) ; C5.1 16.22,43.65 17.53,44.97 R14.2 R10.2 21.34,44.2 23.11,44.2 R11.2 21.37,47.47 CARD1.4 ; U2.4 U2.2 ; U2.4 8.38,43.69 3.05,43.69 J1.2 ; v1(10.91,32.01) 10.91,30.73 10.16,29.97 10.16,27.93 R15.1 10.42,26.16 14.48,26.16 15.53,25.11 C10.1 ; v1(10.91,32.01) R7.2 ; C10.1 C9.1 15.53,22.06 R6.1 ; C10.1 18.35,24.64 20.31,26.59 20.31,26.6 ; 20.31,26.6 21.76,28.06 U3.3
+5V: length 14.1
  Top Layer w0.508: C3.1 2.29,51.96 D4.1 ; C3.1 C2.1 5.71,50.58 6.08,50.21 6.08,52.56 C1.1 ; C3.1 1.81,50.58 1.02,49.78 1.02,48.26 J1.1
GND: length 4.7
  Top Layer w0.254: U5.2 15.02,5.59 v1(16.04,6.6) ; v1(8.38,20.03) C12.2 ; C14.2 C20.2
  vias: v1(1.27,53.85) v1(3.4,57.32) v1(8.89,24.13) v1(9.45,17.63) v1(9.8,57.32) v1(10.41,55.27) v1(10.92,10.16) v1(12.7,46.23) v1(12.72,14.1) v1(12.95,29.46) v1(12.95,11.68) v1(13.72,9.12) v1(13.97,34.04) v1(14.73,30.99) v1(14.73,16.26) v1(17.78,26.42) v1(17.81,12.95) v1(17.98,37.59) v1(18.29,43.43) v1(18.35,23.5) v1(18.77,9.14) v1(19.56,13.72) v1(19.59,33.63) v1(19.81,55.88) v1(20.91,11.13) v1(21.08,15.49) v1(21.89,45.43) v1(23.29,30.79) v1(23.37,20.07) v1(23.57,48.55) v1(25.15,53.34)
VDD3P3: length 4.5
  Top Layer w0.254: 10.27,16.65 10.63,16.3 U4.2 U4.3 ; L1.2 9.65,18.29 10.04,17.9 C15.1
VDD33: length 35.7
  Top Layer w0.254: R6.2 15.49,21.05 C21.1 C20.1 13.04,18.42 U4.55 ; 16.36,16.72 16.18,16.89 13.62,16.89 v1(13.44,16.72) 13.4,16.72 13.06,17.06 13.06,17.48 U4.55 ; 16.36,16.72 16.36,16.8 16.64,17.08 U4.46 ; 16.36,16.72 v1(17.86,16.72) ; U4.55 U4.56 11.56,17.5 10.92,18.15 10.92,18.54 10.37,19.08 10.37,19.79 L1.1 ; U4.20 14.64,11.59 v1(14.73,11.64) ; L1.1 10.89,21.75 R5.2 ; L1.1 9.05,21.12 C13.1 C12.1
  Bottom Layer w0.254: v1(17.81,9.14) 15.75,9.14 14.73,10.16 v1(14.73,11.64) 13.44,12.93 v1(13.44,16.72) ; v1(17.86,16.72) 18.96,16.72 v1(19.78,17.53)
VDDSPI: length 2.5
  Top Layer w0.254: U4.29 19.02,11.13 C17.1 C16.2
CHIP_PU: length 37.2
  Top Layer w0.254: 21.07,32.27 22.36,32.27 22.57,32.48 22.57,40.84 ; 21.07,32.27 20.87,32.48 C7.1 20.87,34.04 20.57,34.33 17.53,34.33 16.76,33.57 16.76,31.45 13,27.69 v1(13,27.43) ; 21.07,32.27 R8.1 ; v1(12.62,15.92) 12.44,15.74 12.44,15.68 12.28,15.52 12.22,15.52 12.2,15.5 U4.4
  Bottom Layer w0.254: v1(11.95,20.89) 11.95,26.38 v1(13,27.43) ; 11.95,20.83 v1(11.95,18.49) 12.62,17.82 v1(12.62,15.92)
D+: length 58.6
  Top Layer w0.254: USB1.6 6.85,58.17 6.6,58.42 6.1,58.42 5.84,58.17 5.84,57.33 USB1.8 5.85,55.11 7.36,53.6 10.68,53.6 11.36,54.29 v1(11.36,54.69) ; v1(17.4,11.48) 17.04,11.12 U4.26
  Bottom Layer w0.254: v1(11.36,54.69) 11.36,54.44 16.44,49.37 16.44,16.37 17.23,15.57 17.23,11.65 v1(17.4,11.48)
D-: length 55.8
  Top Layer w0.254: 6.35,55.72 7.35,56.72 USB1.5 ; 6.35,55.72 6.35,55.18 7.53,54.01 8.78,54.01 v1(9.46,54.69) ; 6.35,55.72 USB1.7 ; 16.63,10.69 16.63,11.39 v1(16.56,11.46)
  Bottom Layer w0.254: v1(16.56,11.46) 16.82,11.73 16.82,15.4 16.02,16.21 16.02,49.21 10.54,54.69 v1(9.46,54.69)
IO0: length 32.3
  Top Layer w0.254: U4.5 12.46,15.1 v1(12.62,14.93) ; C6.1 9.62,32.47 R7.1 8.64,32.26 7.91,32.98 SW1.3
  Bottom Layer w0.254: v1(7.91,32.88) 7.99,32.88 11.37,29.5 11.37,16.25 12.62,15 v1(12.62,14.93)
IO1: length 31.1
  Top Layer w0.254: U4.6 11.41,14.7 6.73,19.37 6.73,37.47 J1.3
IO2: length 29
  Top Layer w0.254: U4.7 11.3,14.3 6.38,19.22 6.38,35.28 J1.4
IO3: length 24.4
  Top Layer w0.254: J1.6 6.02,30.56 6.02,19.08 11.2,13.9 U4.8
IO4: length 22.3
  Top Layer w0.254: U4.9 11.09,13.5 5.66,18.93 5.66,28.37 J1.7
IO5: length 20.2
  Top Layer w0.254: J1.8 5.31,26.19 5.31,18.78 10.99,13.1 U4.10
IO6: length 18.1
  Top Layer w0.254: U4.11 10.89,12.7 4.95,18.63 4.95,24.01 J1.9
IO7: length 16
  Top Layer w0.254: J1.10 4.59,21.82 4.59,18.49 10.78,12.3 U4.12
IO8: length 14
  Top Layer w0.254: J1.11 4.24,19.64 4.24,18.34 10.68,11.9 U4.13
IO9: length 11.3
  Top Layer w0.254: J1.13 5.82,16.26 10.56,11.52 11.81,11.52 U4.14
IO10: length 11.4
  Top Layer w0.254: J1.14 7.86,13.72 10.45,11.12 12.21,11.12 U4.15
IO11: length 12.4
  Top Layer w0.254: J1.15 4.72,8.99 11.77,8.99 13.04,10.26 U4.16
IO12: length 12.1
  Top Layer w0.254: U4.17 13.44,10.16 11.92,8.64 J1.16
IO13: length 16.7
  Top Layer w0.254: J2.16 26.16,6.86 17.14,6.86 13.84,10.16 U4.18
IO14: length 17
  Top Layer w0.254: J2.15 23.98,7.21 17.29,7.21 14.24,10.26 U4.19
IO15: length 17.1
  Top Layer w0.254: J2.14 21.79,7.57 17.53,7.57 15.04,10.06 U4.21
IO16: length 17.4
  Top Layer w0.254: J2.13 19.61,7.93 17.67,7.93 15.44,10.16 U4.22
IO21: length 18.4
  Top Layer w0.254: J2.11 26.81,20.21 26.81,15.63 21.22,10.04 17.62,10.04 17.44,10.22 U4.27
IO38: length 12.9
  Top Layer w0.254: J2.10 23.89,23.88 17.84,17.83 U4.43
IO39: length 14.4
  Top Layer w0.254: J2.9 25.92,26.42 17.44,17.93 U4.44
IO40: length 16
  Top Layer w0.254: J2.8 27.94,28.94 17.04,18.04 U4.45
IO41: length 18.8
  Top Layer w0.254: U4.47 16.24,17.93 25.66,27.35 25.66,29.21 J2.7
IO42: length 21.5
  Top Layer w0.254: U4.48 15.84,18.04 25.3,27.5 25.3,31.4 J2.6
IO43: length 26.8
  Top Layer w0.254: J2.4 24.94,36.12 24.94,27.64 15.44,18.14 U4.49
IO44: length 29.5
  Top Layer w0.254: J2.3 24.59,38.3 24.59,27.79 15.04,18.24 U4.50
IO45: length 32.2
  Top Layer w0.254: U4.51 14.64,18.35 24.23,27.94 24.23,40.49 J2.2
IO46: length 35.1
  Top Layer w0.254: U4.52 14.24,18.45 23.88,28.08 23.88,42.93 27.69,46.74 J2.1
LNA_IN: length 12.6
  Top Layer w0.254: U4.1 11.26,17.27 v1(10.78,17.27)
  Bottom Layer w0.508: 9.14,10.92 10.78,12.56 v1(10.78,17.27) ; v1(9.21,6.6) 9.14,6.67 v1(9.14,10.89)
RGB: length 16.3
  Top Layer w0.254: U4.37 v1(19.38,14.7)
  Bottom Layer w0.254: v1(19.38,14.7) 21.84,17.16 21.84,25.08 v1(18.9,28.03)
SD_CLK: length 44
  Top Layer w0.254: v1(15.75,11.48) 15.84,11.39 U4.23
  Bottom Layer w0.254: v1(22.47,48.55) 22.47,43.06 24.13,41.4 24.13,33.78 22.2,31.85 22.2,15.45 17.63,10.88 16.32,10.88 15.75,11.45 v1(15.75,11.48)
SD_CMD: length 37.1
  Top Layer w0.254: v1(20.57,46.47) 20.27,46.78 CARD1.3 ; v1(17.89,14.42) 18.02,14.3 U4.36
  Bottom Layer w0.254: v1(17.89,14.42) 17.89,15.41 16.79,16.51 16.79,30 20.57,33.78 v1(20.57,46.47)
SD_DA0: length 43.9
  Top Layer w0.254: v1(16.65,9.78) 16.65,9.85 16.26,10.24 16.26,10.67 U4.24 ; CARD1.7 24.67,47.27 v1(23.88,46.47)
  Bottom Layer w0.254: v1(23.88,46.47) 23.88,42.16 24.49,41.55 24.49,17.24 17.03,9.78 v1(16.65,9.78)
$1N538: length 5.4
  Top Layer w0.254: USB1.3 8.35,58.19 7.72,58.83 5.86,58.83 5.35,58.32 USB1.9
$1N689: length 2
  Top Layer w0.254: USB1.10 4.85,55.39 R2.2
$1N692: length 1.7
  Top Layer w0.254: USB1.4 7.85,56.42 R1.2
$1N1157: length 9
  Top Layer w0.254: D4.2 3.3,55.99 4.2,56.9 USB1.11 4.2,57.76 5.63,59.18 7.96,59.18 8.72,58.42 8.72,58.06 9,57.78 USB1.2
$1N2238: length 1.9
  Top Layer w0.254: LED1.1 11.21,27.48 R15.2
$1N15680: length 2.1
  Top Layer w0.254: CARD1.2 19.17,46.59 R14.1
$1N27615: length 4.9
  Top Layer w0.254: C22.1 12.25,6.63
  Top Layer w0.508: L2.1 L3.2 12.25,6.03 U5.1
$1N42405: length 1.3
  Top Layer w0.254: L3.1 C24.1

## Copper pours and planes (outline as drawn; the poured copper is in the pictures)
GND on Top Layer: -5.33,67.06 31.75,67.06 31.75,6.1 -5.33,6.1
GND on Bottom Layer: -5.33,67.06 30.99,67.06 30.99,6.1 -5.33,6.1

## Text on the board
Bottom Silkscreen Layer: IO46 | IO45 | IO44 | IO43 | GND | IO42 | IO41 | IO40 | IO39 | IO38 | IO21 | IO16 | IO15 | IO14 | IO13 | 5V | 3V3 | IO1 | IO2 | IO3 | IO4 | IO5 | IO6 | IO7 | IO8 | IO9 | IO10 | IO11 | IO12 | Made by Shubham

# Board PCB1_1
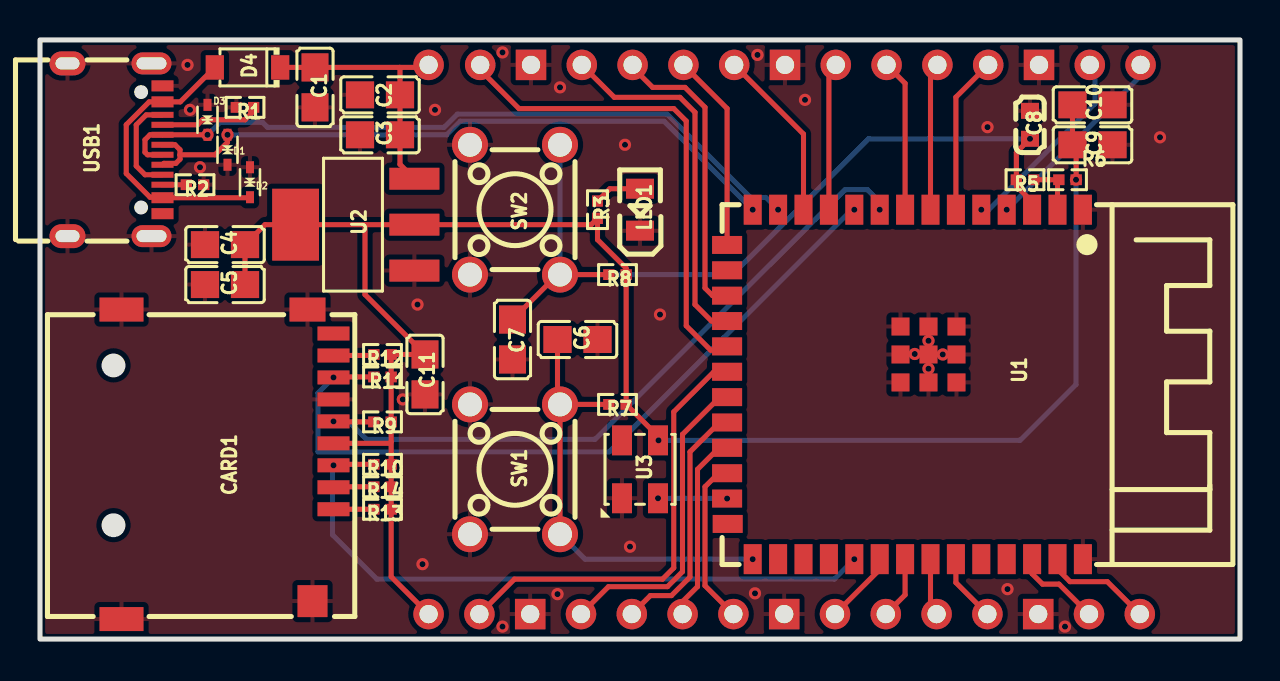
[diagram p4: board, top side]
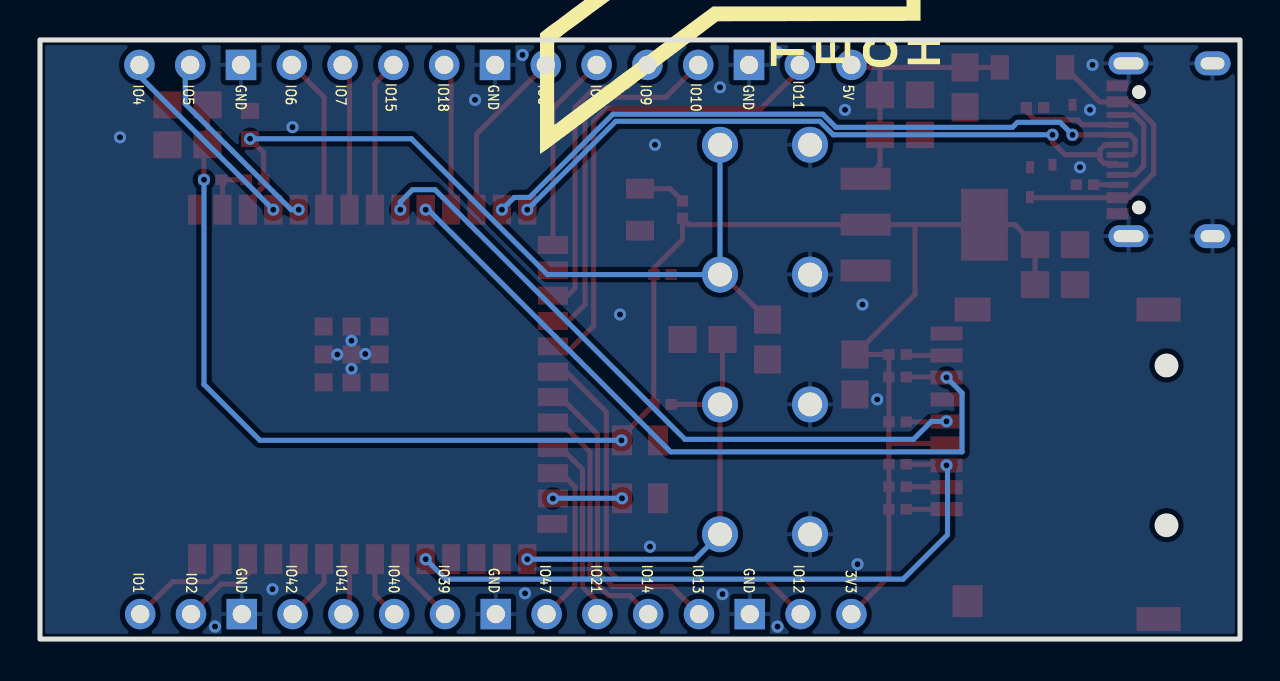
[diagram p5: board, bottom side, seen from below]

Outline 60 x 30 mm; copper layers: Top Layer, Bottom Layer. Coordinates in mm from the lower left corner of the outline.
Outline path: rectangle 0,0 60,30
Stack: Top Layer 0.035mm / Dielectric1 1.51mm FR4 er 4.5 / Bottom Layer 0.035mm

## Design rules (mm)
template: JLCPCB Capability(Two Layers Board)
spacing copperThickness1oz (default): track to track 0.102, other pairs 0.152 to 0.3
spacing copperThickness2oz: track to track 0.203, other pairs 0.152 to 0.3
track width copperThickness1oz (default): min 0.127, default 0.254, max 2.54
track width copperThickness2oz: min 0.203, default 0.254, max 2.54
differential pair differentialPair (default): width min 0.127, default 0.254, max 2.54; gap min 0.152, default 0.152
via viaSize (default): diameter min 0.5, default 0.61, max 10; hole min 0.3, default 0.305, max 6.3

## Placement (name value [footprint] x y rotation side)
C1  10uF  [C0805]  13.75 27.62 90 top
C2  100nF  [C0805]  17 27.25 0 top
C3  10uF  [C0805]  17 25.25 0 top
C4  100nF  [C0805]  9.25 19.75 0 top
C5  10uF  [C0805]  9.25 17.75 0 top
C6  100nF  [C0805]  26.88 15 180 top
C7  100nF  [C0805]  23.62 15 90 top
C8  1uF  [C0603]  49.5 25.75 270 top
C9  10uF  [C0805]  52.62 24.75 180 top
C10  100nF  [C0805]  52.62 26.75 180 top
C11  100nF  [C0805]  19.25 13.25 270 top
CARD1  THD2528-11SD-GF  [TF-SMD_THD2528-11SD-GF]  9.38 8.75 270 top
D1  LESD5D5.0CT1G  [SOD-523_L1.2-W0.8-LS1.6-BI]  10.5 22.88 270 top
D2  LESD5D5.0CT1G  [SOD-523_L1.2-W0.8-LS1.6-BI]  9.38 24.5 90 top
D3  LESD5D5.0CT1G  [SOD-523_L1.2-W0.8-LS1.6-BI]  8.38 26 270 top
D4  1N5819HW-7-F  [SOD-123_L2.7-W1.6-LS3.7-RD]  10.38 28.62 180 top
J1  -  [CONN-TH_14]  37.25 28.75 270 top
J2  -  [CONN-TH_14]  37.21 1.25 270 top
J3  -  [CONN-TH_1]  19.68 28.75 270 top
J4  -  [CONN-TH_1]  19.18 1.25 90 top
LED1  LTST-C170KRKT  [LED0805-R-RD]  30 21.5 90 top
R1  5.1kΩ  [R0402]  10.25 26.62 0 top
R2  5.1kΩ  [R0402]  7.75 22.75 180 top
R3  5.1kΩ  [R0402]  27.88 21.5 270 top
R5  10kΩ  [R0402]  49.25 23 0 top
R6  0Ω  [R0402]  51.38 23 180 top
R7  10kΩ  [R0402]  28.88 11.75 0 top
R8  10kΩ  [R0402]  28.88 18.25 0 top
R9  10kΩ  [R0402]  17.12 10.88 0 top
R10  10kΩ  [R0402]  17.12 8.75 0 top
R11  10kΩ  [R0402]  17.12 13.12 0 top
R12  10kΩ  [R0402]  17.12 14.25 0 top
R13  10kΩ  [R0402]  17.12 6.5 0 top
R14  10kΩ  [R0402]  17.12 7.62 0 top
SW1  1825910-6  [SW-TH_4P-L6.0-W6.0-P4.50-LS6.5]  23.75 8.5 90 top
SW2  1825910-6  [SW-TH_4P-L6.0-W6.0-P4.50-LS6.5]  23.75 21.5 90 top
U1  ESP32-S3-WROOM-1-N16R8  [WIRELM-SMD_ESP32-S3-WROOM-1]  43.25 12.75 270 top
U2  AMS1117-3.3  [SOT-223-3_L6.4-W3.5-P2.30-LS7.0-BR]  15.75 20.75 0 top
U3  SK6812MINI-HS  [LED-SMD_4P-L3.5-W3.5-BR_SK6812MINI-HS]  30 8.5 270 top
USB1  TYPE-C 16PIN 2MD(073)  [USB-C-SMD_TYPE-C-6PIN-2MD-073]  3.75 24.5 270 top

## Footprints (pads in the part's own frame, mm; a bottom-side part is the same pattern mirrored in y, then rotated)
C0603
  rect 0.8x0.9 smd: 1(-0.7,0) 2(0.7,0)
C0805
  rect 1.41x1.35 smd: 1(-1,0) 2(1,0)
CONN-TH_1
  round 1.524 hole 0.914: 1(0,-0.254)
CONN-TH_14
  round 1.524 hole 0.914: 1(0,17.78) 2(0,15.24) 4(0,10.16) 5(0,7.62) 6(0,5.08) 7(0,2.54) 9(0,-2.54) 10(0,-5.08) 11(0,-7.62) 12(0,-10.16) 14(0,-15.24)
  rect 1.524x1.524 hole 0.914: 3(0,12.7) 8(0,0) 13(0,-12.7)
LED0805-R-RD
  rect 1x1.399 smd: 1(1.05,0) 2(-1.05,0)
LED-SMD_4P-L3.5-W3.5-BR_SK6812MINI-HS
  rect 1.5x1 smd: 1(1.45,-0.9) 2(1.45,0.9) 3(-1.45,0.9) 4(-1.45,-0.9)
R0402
  rect 0.566x0.54 smd: 1(-0.433,0) 2(0.433,0)
SOD-123_L2.7-W1.6-LS3.7-RD
  rect 0.91x1.22 smd: 1(-1.635,0) 2(1.635,0)
SOD-523_L1.2-W0.8-LS1.6-BI
  rect 0.6x0.4 smd: 1(-0.75,0) 2(0.75,0)
SOT-223-3_L6.4-W3.5-P2.30-LS7.0-BR
  rect 2.5x1.1 smd: 1(2.97,-2.3) 2(2.97,0) 3(2.97,2.3)
  rect 2.34x3.6 smd: 4(-2.97,0)
SW-TH_4P-L6.0-W6.0-P4.50-LS6.5
  round 1.8 hole 1.2: 1(-3.25,2.25) 2(3.25,2.25) 3(-3.25,-2.25) 4(3.25,-2.25)
TF-SMD_THD2528-11SD-GF
  rect 0.7x1.6 smd: 1(2.25,5.3) 2(1.15,5.3) 3(0.05,5.3) 4(-1.05,5.3) 5(-2.15,5.3) 6(-3.25,5.3) 7(-4.35,5.3) 8(-5.45,5.3) 9(-6.55,5.3)
  rect 1.2x1.8 smd: 10(-7.75,4)
  rect 1.2x2.2 smd: 11(-7.75,-5.3) 12(7.75,-5.3)
  rect 1.6x1.5 smd: 13(6.85,4.25)
USB-C-SMD_TYPE-C-6PIN-2MD-073
  rect 0.55x1.1 smd: 1(-3.2,2.375) 2(-2.4,2.375) 11(2.4,2.375) 12(3.2,2.375)
  rect 0.3x1.1 smd: 3(-1.75,2.375) 4(-1.25,2.375) 5(-0.75,2.375) 6(-0.25,2.375) 7(0.25,2.375) 8(0.75,2.375) 9(1.25,2.375) 10(1.75,2.375)
  oval 1.1x2 hole 0.6x1.5: 13(-4.325,1.825) 14(4.325,1.825)
  oval 1.2x1.8 hole 0.6x1.2: 13(-4.325,-2.375) 14(4.325,-2.375)
WIRELM-SMD_ESP32-S3-WROOM-1
  rect 1.5x0.9 smd: 1(-8.75,8.895) 2(-8.75,7.625) 3(-8.75,6.355) 4(-8.75,5.085) 5(-8.75,3.815) 6(-8.75,2.545) 7(-8.75,1.275) 8(-8.75,0.005) 9(-8.75,-1.265) 10(-8.75,-2.535) 11(-8.75,-3.805) 12(-8.75,-5.075) 13(-8.75,-6.345) 14(-8.75,-7.615) 27(8.75,-7.615) 28(8.75,-6.345) 29(8.75,-5.075) 30(8.75,-3.805) 31(8.75,-2.535) 32(8.75,-1.265) 33(8.75,0.005) 34(8.75,1.275) 35(8.75,2.545) 36(8.75,3.815) 37(8.75,5.085) 38(8.75,6.355) 39(8.75,7.625) 40(8.75,8.895)
  rect 0.9x1.5 smd: 15(-6.985,-8.895) 16(-5.715,-8.895) 17(-4.445,-8.895) 18(-3.175,-8.895) 19(-1.905,-8.895) 20(-0.635,-8.895) 21(0.635,-8.895) 22(1.905,-8.895) 23(3.175,-8.895) 24(4.445,-8.895) 25(5.715,-8.895) 26(6.985,-8.865)
  rect 0.9x0.9 smd: 41(-2.9,2.575) 41(-2.9,1.175) 41(-2.9,-0.225) 41(-1.5,2.575) 41(-1.5,1.175) 41(-1.5,-0.225) 41(-0.1,2.575) 41(-0.1,1.175) 41(-0.1,-0.225)

## Nets
As in the schematic.

Pads without a net: CARD1 9; U1 16 26 28 29 30 36 37; U3 4; USB1 12

## Via types
v1: diameter 0.61, hole 0.305, Top Layer to Bottom Layer, 43 vias

## Routing (per net, layer and track width the routed paths; a pad name or vN(x,y) marks a point on that pad's centre or on a via; arc(x,y) is an arc through that point)
+3V3: length 94.8
  Top Layer w0.254: J4.1 17.56,3.12 R13.2 R14.2 R10.2 17.56,9.88 ; 16.25,20.75 U2.4 11.25,20.75 C4.2 C5.2 ; 16.25,20.75 U2.2 27.56,20.75 R3.2 27.88,20 29.31,18.57 R8.2 R7.2 30.93,10.13 v1(30.93,9.95) ; 16.25,20.75 16.25,17.25 C11.1 R12.2 R11.2 R9.2 17.56,9.88 ; 17.56,9.88 17.48,9.8 CARD1.4 ; R6.1 51.81,24.57 C9.2 C10.2
  Bottom Layer w0.254: v1(30.93,9.95) 49,9.95 51.8,12.75 v1(51.8,23)
+5V: length 13.4
  Top Layer w0.254: J3.1 19.31,28.62 17.99,28.62 ; 17.99,28.62 C1.2 D4.1 ; 17.99,28.62 18,28.61 C2.2 C3.2 18,23.77 U2.3
GND:
  vias: v1(7.38,28.75) v1(7.5,26.5) v1(8,23.62) v1(18.14,12) v1(18.88,16.75) v1(19.12,3.75) v1(19.75,26.5) v1(23.12,29.38) v1(23.12,0.62) v1(25.88,2.25) v1(26,27.62) v1(29.25,24.75) v1(29.5,4.62) v1(31,16.25) v1(35.75,2.29) v1(35.88,29.25) v1(38.25,27) v1(43.74,14.28) v1(44.43,14.94) v1(44.43,13.54) v1(45.14,14.25) v1(47.38,25.63) v1(48.38,2.5) v1(51.25,0.62) v1(56,25.12)
CHIP_PU: length 42.7
  Top Layer w0.254: R8.1 SW2.3 25.88,18.25 C7.2 ; v1(49.5,25.05) 48.82,24.37 48.82,22.68 49.61,21.89 U1.3
  Bottom Layer w0.254: v1(49.5,25.05) 41.43,25.05 34.63,18.25 SW2.3 26,24.75
D+: length 33.8
  Top Layer w0.254: 7,24.24 7,24.03 6.79,23.82 6.2,23.82 USB1.8 ; 7,24.24 7,24.5 6.75,24.75 USB1.6 ; 7,24.24 7.01,24.25 8.75,24.25 9.38,24.88 v1(9.38,25.25)
  Bottom Layer w0.254: v1(9.38,25.25) 20.33,25.25 21.01,25.93 31.21,25.93 v1(35.64,21.5)
D-: length 35.9
  Top Layer w0.254: 8.38,25.25 5.5,25.25 5.25,25 5.25,24.38 5.38,24.25 6.12,24.25
  Bottom Layer w0.254: v1(36.91,21.5) 36.29,22.11 35.53,22.11 31.35,26.28 20.86,26.28 20.2,25.62 11.38,25.62 11.12,25.88 9,25.88 v1(8.38,25.25)
ESP_3V3: length 2.8
  Top Layer w0.254: R5.2 R6.2 50.88,22.93 U1.2
GPIO0: length 22.4
  Top Layer w0.254: C6.2 25.88,11.87 26,11.75 SW1.3 ; R7.1 SW1.4
  Bottom Layer w0.254: v1(35.64,4) 27.25,4 SW1.3
IO1: length 5.5
  Top Layer w0.254: U1.39 50.88,3.5 51.5,2.88 53.37,2.88 J2.1
IO2: length 4.4
  Top Layer w0.254: J2.2 50.95,2.75 50.12,2.75 49.61,3.27 U1.38
IO3: length 9.9
  Top Layer w0.254: 34.36,19.73 34.36,26.56 J1.10
IO4: length 10
  Bottom Layer w0.254: J1.1 55.03,28.2 v1(48.34,21.5)
IO5: length 9.9
  Bottom Layer w0.254: J1.2 52.74,28.5 52.74,26.8 47.44,21.5 v1(47.06,21.5)
IO6: length 7.9
  Top Layer w0.254: J1.4 45.8,27.13 45.8,21.5
IO7: length 7.4
  Top Layer w0.254: J1.5 44.53,28.4 U1.7
IO8: length 8.7
  Top Layer w0.254: U1.12 38.18,25.28 J1.9
IO9: length 14.9
  Top Layer w0.254: 34.36,17.2 33.63,17.2 33.25,17.58 33.25,26.62 32.25,27.62 30.63,27.62 29.63,28.62 J1.11
IO10: length 18.2
  Top Layer w0.254: 34.36,15.92 33.58,15.92 32.75,16.75 32.75,26.38 32,27.12 28.72,27.12 J1.12
IO11: length 24.5
  Top Layer w0.254: J1.14 21.95,28.69 21.95,28.56 23.95,26.56 31.69,26.56 32.31,25.94 32.31,15.69 33.53,14.47 34.17,14.47 34.36,14.66
IO12: length 22
  Top Layer w0.254: J2.14 23.72,3 31.12,3 31.69,3.56 31.69,11.38 33.7,13.39 34.36,13.39
IO13: length 15.8
  Top Layer w0.254: J2.12 28.43,2.62 31.38,2.62 32.12,3.38 32.12,10.25 33.99,12.11 34.36,12.11
IO14: length 12.4
  Top Layer w0.254: J2.11 30.52,2.18 31.57,2.18 32.5,3.1 32.5,9.38 33.97,10.84 34.36,10.84
IO15: length 7.6
  Top Layer w0.254: U1.8 43.25,27.83 J1.6
IO18: length 7.4
  Top Layer w0.254: U1.11 39.44,28.4 J1.7
IO21: length 9.5
  Top Layer w0.254: J2.10 32.13,1.88 32.88,2.62 32.88,8.5 33.95,9.58 34.36,9.58
IO39: length 3.7
  Top Layer w0.254: U1.32 41.99,3.48 J2.7
IO40: length 3.1
  Top Layer w0.254: J2.6 43.25,2.21 U1.33
IO41: length 2.9
  Top Layer w0.254: U1.34 44.53,1.56 J2.5
IO42: length 3.4
  Top Layer w0.254: J2.4 45.8,2.83 45.8,4
IO47: length 8.4
  Top Layer w0.254: J2.9 33.25,2.67 33.25,7.62 33.93,8.31 34.36,8.31
RGB: length 3.5
  Bottom Layer w0.254: v1(34.36,7.03) 34.34,7.05 v1(30.9,7.05)
SD_CLK: length 35.5
  Top Layer w0.254: v1(14.68,10.9) 14.7,10.88 R9.1
  Bottom Layer w0.254: v1(14.68,10.9) 15.43,10.9 16.33,10 27.75,10 40.25,22.5 41.38,22.5 41.99,21.89 v1(41.99,21.5)
SD_CMD: length 33
  Top Layer w0.254: v1(14.68,8.7) 14.72,8.75 R10.1
  Bottom Layer w0.254: v1(14.68,8.7) 14.62,8.65 14.62,5.22 16.84,3 39.72,3 v1(40.72,4)
SD_DA0: length 37.9
  Top Layer w0.254: v1(14.68,13.1) 14.7,13.12 R11.1
  Bottom Layer w0.254: v1(14.68,13.1) 13.9,12.32 13.9,9.38 28.47,9.38 40.59,21.5 v1(40.72,21.5)
$1N538: length 5.1
  Top Layer w0.254: USB1.9 5.25,23.25 4.81,23.69 4.81,25.75 5.31,26.25 6.12,26.25
$1N689: length 1.2
  Top Layer w0.254: 7.32,22.75 6.13,22.75
$1N692: length 5
  Top Layer w0.254: 6.12,25.75 7.88,25.75 8.12,26 10.25,26 10.68,26.43 R1.2
$1N1157: length 14.8
  Top Layer w0.254: D1.2 10.47,22.1 USB1.11 6.1,22.12 5.5,22.12 4.31,23.31 4.31,25.75 5.46,26.9 USB1.2 7.02,26.9 D4.2
$1N2238: length 2.4
  Top Layer w0.254: LED1.1 28.49,22.55 R3.1
$1N15670: length 2
  Top Layer w0.254: R13.1 CARD1.1
$1N15680: length 2
  Top Layer w0.254: R14.1 14.7,7.62 CARD1.2
$1N15711: length 2
  Top Layer w0.254: CARD1.8 16.64,14.2 R12.1

## Copper pours and planes (outline as drawn; the poured copper is in the pictures)
GND on Top Layer: 0,-0.12 0,29.88 60,29.88 60,-0.12
GND on Bottom Layer: 0,0 0,30 60,30 60,0

## Text on the board
Bottom Silkscreen Layer: 5V | IO11 | GND | IO10 | IO9 | IO3 | IO8 | IO18 | IO15 | IO7 | IO6 | IO5 | IO4 | 3V3 | IO12 | IO13 | IO14 | IO21 | IO47 | IO39 | IO40 | IO41 | IO42 | IO2 | IO1
